# EAGLE design ibz_bldc_drv_revA (EAGLE 9.6.2)

## Sheet 1 of 6: Blockschema
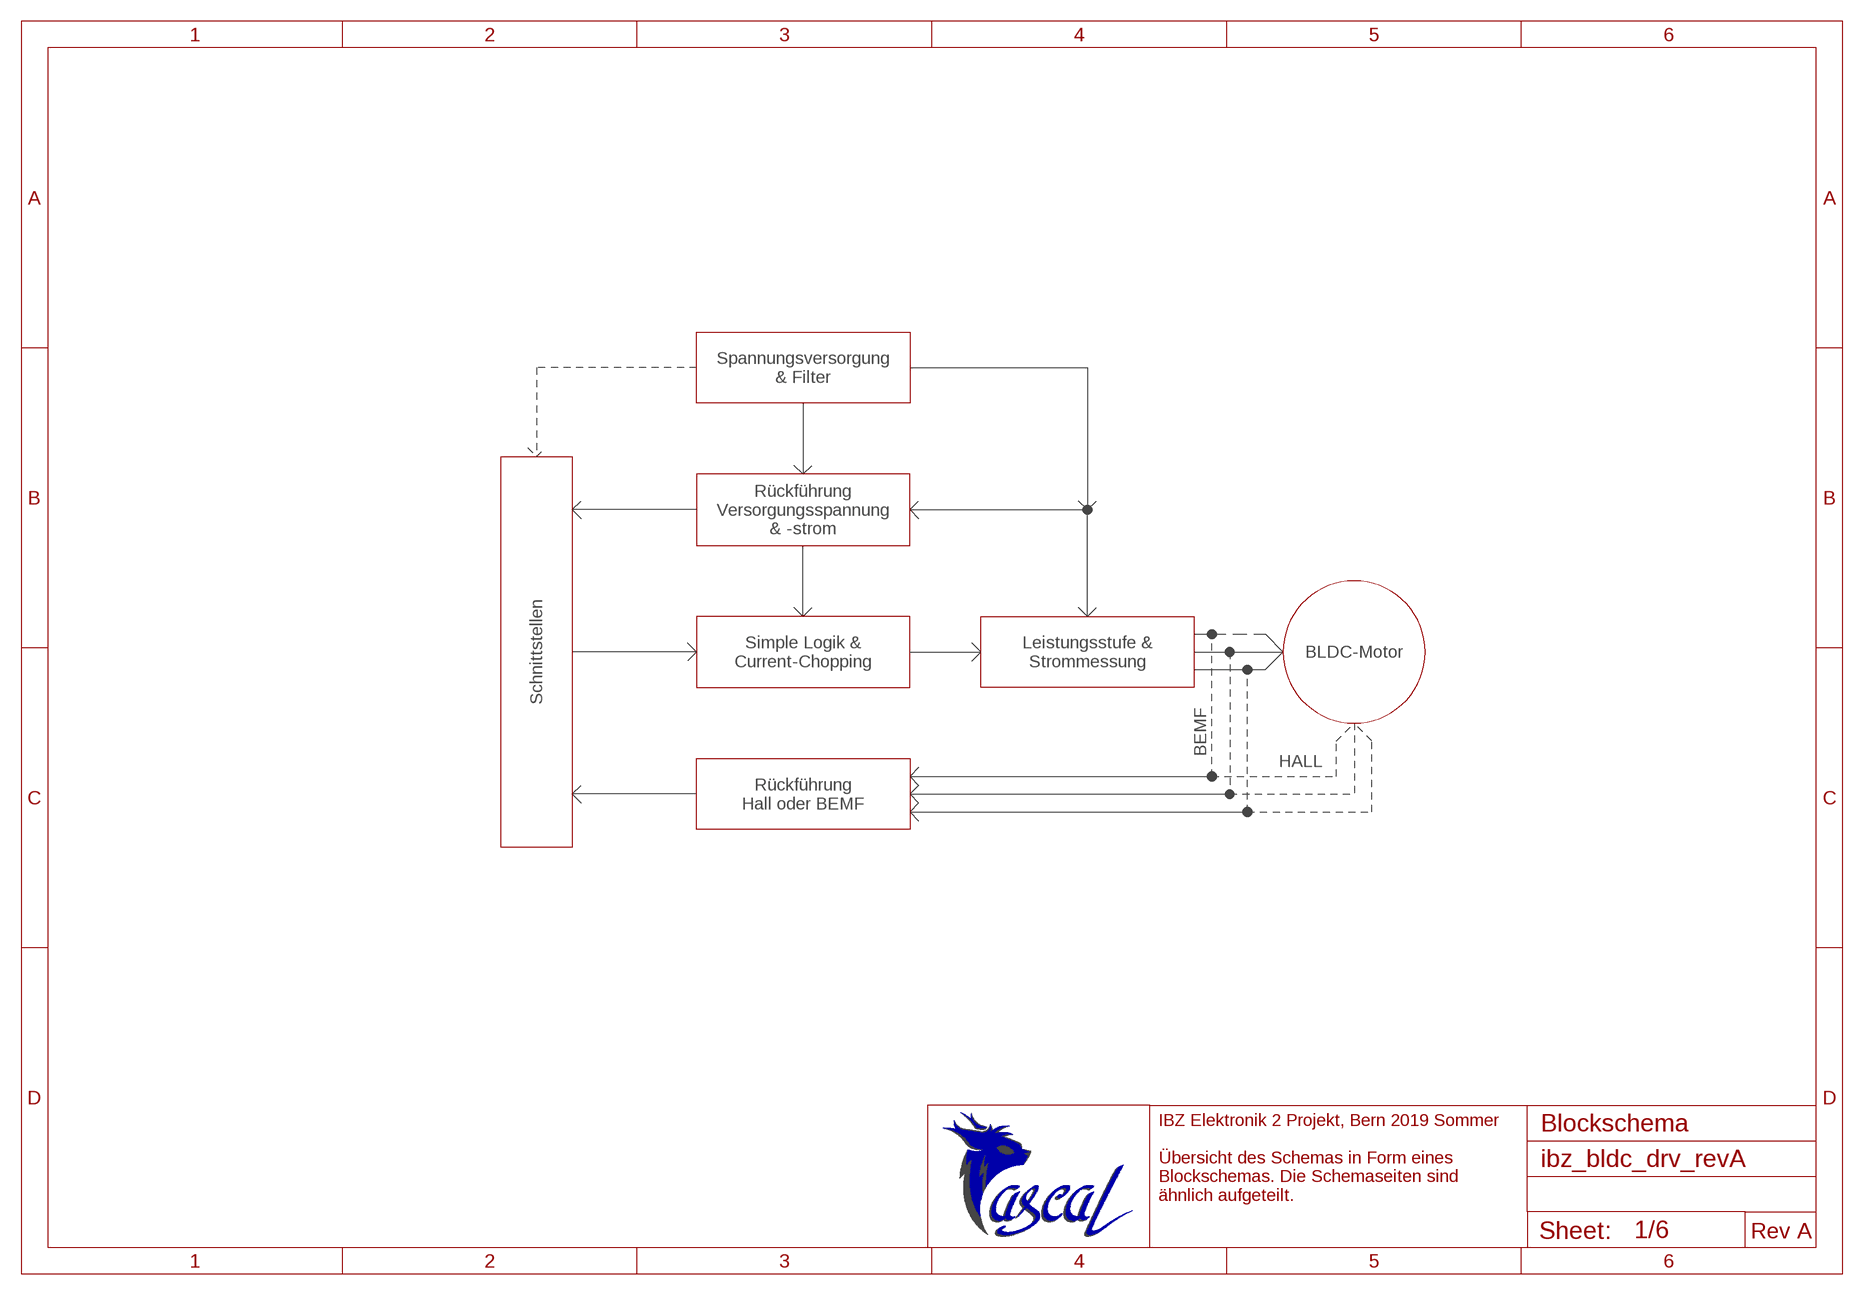
[diagram p0: schematic, sheet 1]

### Notes on the sheet
- Spannungsversorgung
  & Filter
- Rückführung
  Versorgungsspannung
  & -strom
- Schnittstellen
- Simple Logik &
  Current-Chopping
- Leistungsstufe &
  Strommessung
- BLDC-Motor
- BEMF
- HALL
- Rückführung
  Hall oder BEMF
- IBZ Elektronik 2 Projekt, Bern 2019 Sommer
  
  Übersicht des Schemas in Form eines
  Blockschemas. Die Schemaseiten sind 
  ähnlich aufgeteilt.
- Blockschema
- Rev A

## Sheet 2 of 6: Spannungsversorgung und Filter
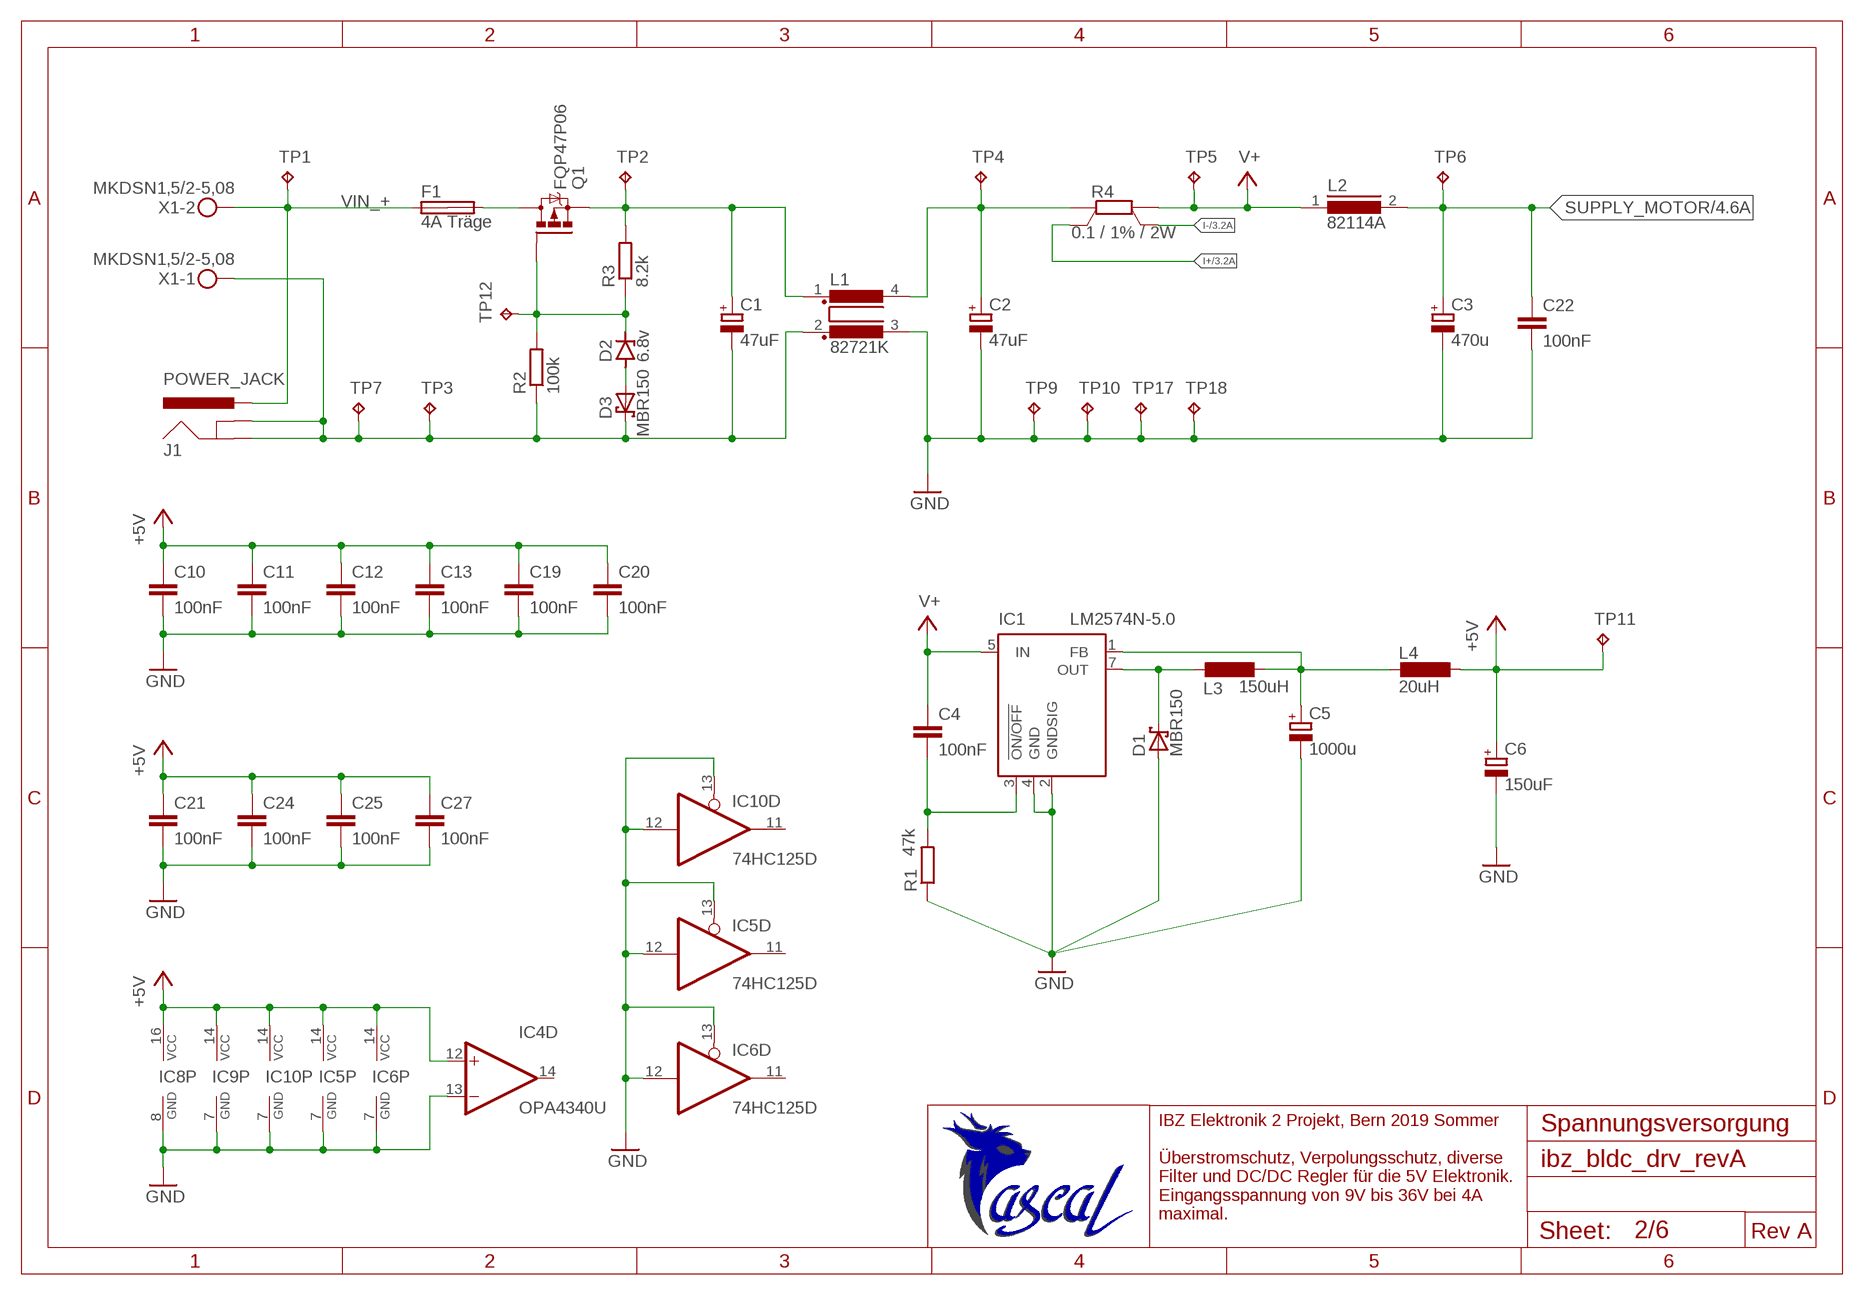
[diagram p1: schematic, sheet 2]

### Parts
C1  47uF  CPOL-EUE22-9AXIAL  [E22-9]
C2  47uF  CPOL-EUE22-9AXIAL  [E22-9]
C3  470u  CPOL-EUE22-9AXIAL  [E22-9]
C4  100nF  C-EUC1206  [C1206]
C5  1000u  CPOL-EUE5-10.5  [E5-10,5]
C6  150uF  CPOL-EU153CLV-1010  [153CLV-1010]
C10  100nF  C-EUC1206  [C1206]
C11  100nF  C-EUC1206  [C1206]
C12  100nF  C-EUC1206  [C1206]
C13  100nF  C-EUC1206  [C1206]
C19  100nF  C-EUC1206  [C1206]
C20  100nF  C-EUC1206  [C1206]
C21  100nF  C-EUC1206  [C1206]
C22  100nF  C-EUC1206  [C1206]
C24  100nF  C-EUC1206  [C1206]
C25  100nF  C-EUC1206  [C1206]
C27  100nF  C-EUC1206  [C1206]
D1  MBR150  SCHOTTKY-DIODEDO41-7  [DO41-7]
D2  6.8v  ZENER-DIODEDO41Z10  [DO41Z10]
D3  MBR150  SCHOTTKY-DIODEDO41-7  [DO41-7]
F1  4A Träge  SHK20Q  [SHK20Q]
IC1  LM2574N-5.0  [DIL08]
IC4  OPA4340U  [SO14]
IC5  74HC125D  [SO14]
IC6  74HC125D  [SO14]
IC8  74HC123D  74LS123D  [SO16]
IC9  74HC08D  74AC08D  [SO14]
IC10  74HC125D  74AC125D  [SO14]
J1  POWER_JACK  [POWER_JACK_PTH]
L1  82721K  [82721K]
L2  82114A  [82114A]
L3  150uH  L-EUIR-2  [IR-2]
L4  20uH  L-EUL5038P  [L5038P]
Q1  FQP47P06  IRF9530  [TO220BV]
R1  47k  R-EU_R1206  [R1206]
R2  100k  R-EU_R1206  [R1206]
R3  8.2k  R-EU_R1206  [R1206]
R4  0.1 / 1% / 2W  PMA-B  [PMA-B]
TP1  TPPAD1-13  [P1-13]
TP2  TPPAD1-13  [P1-13]
TP3  TPPAD1-13  [P1-13]
TP4  TPPAD1-13  [P1-13]
TP5  TPPAD1-13  [P1-13]
TP6  TPPAD1-13  [P1-13]
TP7  TPPAD1-13  [P1-13]
TP9  TPPAD1-13  [P1-13]
TP10  TPPAD1-13  [P1-13]
TP11  TPPAD1-13  [P1-13]
TP12  TPPAD1-13  [P1-13]
TP17  TPPAD1-13  [P1-13]
TP18  TPPAD1-13  [P1-13]
X1  MKDSN1,5/2-5,08  [MKDSN1,5/2-5,08]

### Nets
+5V: C6.+ C10.1 C11.1 C12.1 C13.1 C19.1 C20.1 C21.1 C24.1 C25.1 C27.1 IC4.12(D:+IN) IC5.14(P:VCC) IC6.14(P:VCC) IC8.16(P:VCC) IC9.14(P:VCC) IC10.14(P:VCC) L4.1 TP11.TP ; also sheet 3,4,5,6
GND: C2.- C3.- C5.- C6.- C10.2 C11.2 C12.2 C13.2 C19.2 C20.2 C21.2 C22.2 C24.2 C25.2 C27.2 D1.A IC1.2(GNDSIG) IC1.4(GND) IC4.13(D:-IN) IC5.7(P:GND) IC5.12(D:I) IC5.13(D:OE) IC6.7(P:GND) IC6.12(D:I) IC6.13(D:OE) IC8.8(P:GND) IC9.7(P:GND) IC10.7(P:GND) IC10.12(D:I) IC10.13(D:OE) L1.3 R1.1 TP9.TP TP10.TP TP17.TP TP18.TP ; also sheet 3,4,5,6
I+: R4.SB ; also sheet 3
I-: R4.SA ; also sheet 3
N$1: C1.- D3.C J1.GND J1.GNDBREAK L1.2 R2.1 TP3.TP TP7.TP X1.1
N$2: C1.+ L1.1 Q1.S R3.2 TP2.TP
N$3: C2.+ L1.4 R4.B TP4.TP
N$4: C4.2 IC1.3(!ON/OFF) R1.2
N$5: C5.+ IC1.1(FB) L3.1 L4.2
N$6: D1.C IC1.7(OUT) L3.2
N$7: F1.2A Q1.D
N$8: D2.C Q1.G R2.2 R3.1 TP12.TP
N$9: D2.A D3.A
SUPPLY_MOTOR: C3.+ C22.1 L2.2 TP6.TP ; also sheet 4
V+: C4.1 IC1.5(IN) L2.1 R4.A TP5.TP ; also sheet 3,6
VIN_+: F1.1A J1.PWR TP1.TP X1.2
Unconnected: F1.1B F1.2B IC4.14(D:OUT) IC5.11(D:O) IC6.11(D:O) IC8.5(B:Q) IC8.6(B:C) IC8.7(B:R/C) IC8.9(B:A) IC8.10(B:B) IC8.11(B:CLR) IC8.12(B:!Q) IC9.11(D:O) IC9.12(D:I0) IC9.13(D:I1) IC10.11(D:O)

### Notes on the sheet
- IBZ Elektronik 2 Projekt, Bern 2019 Sommer
  
  Überstromschutz, Verpolungsschutz, diverse
  Filter und DC/DC Regler für die 5V Elektronik.
  Eingangsspannung von 9V bis 36V bei 4A
  maximal.
- Spannungsversorgung
- Rev A

## Sheet 3 of 6: Rückführung Strom & Spannung
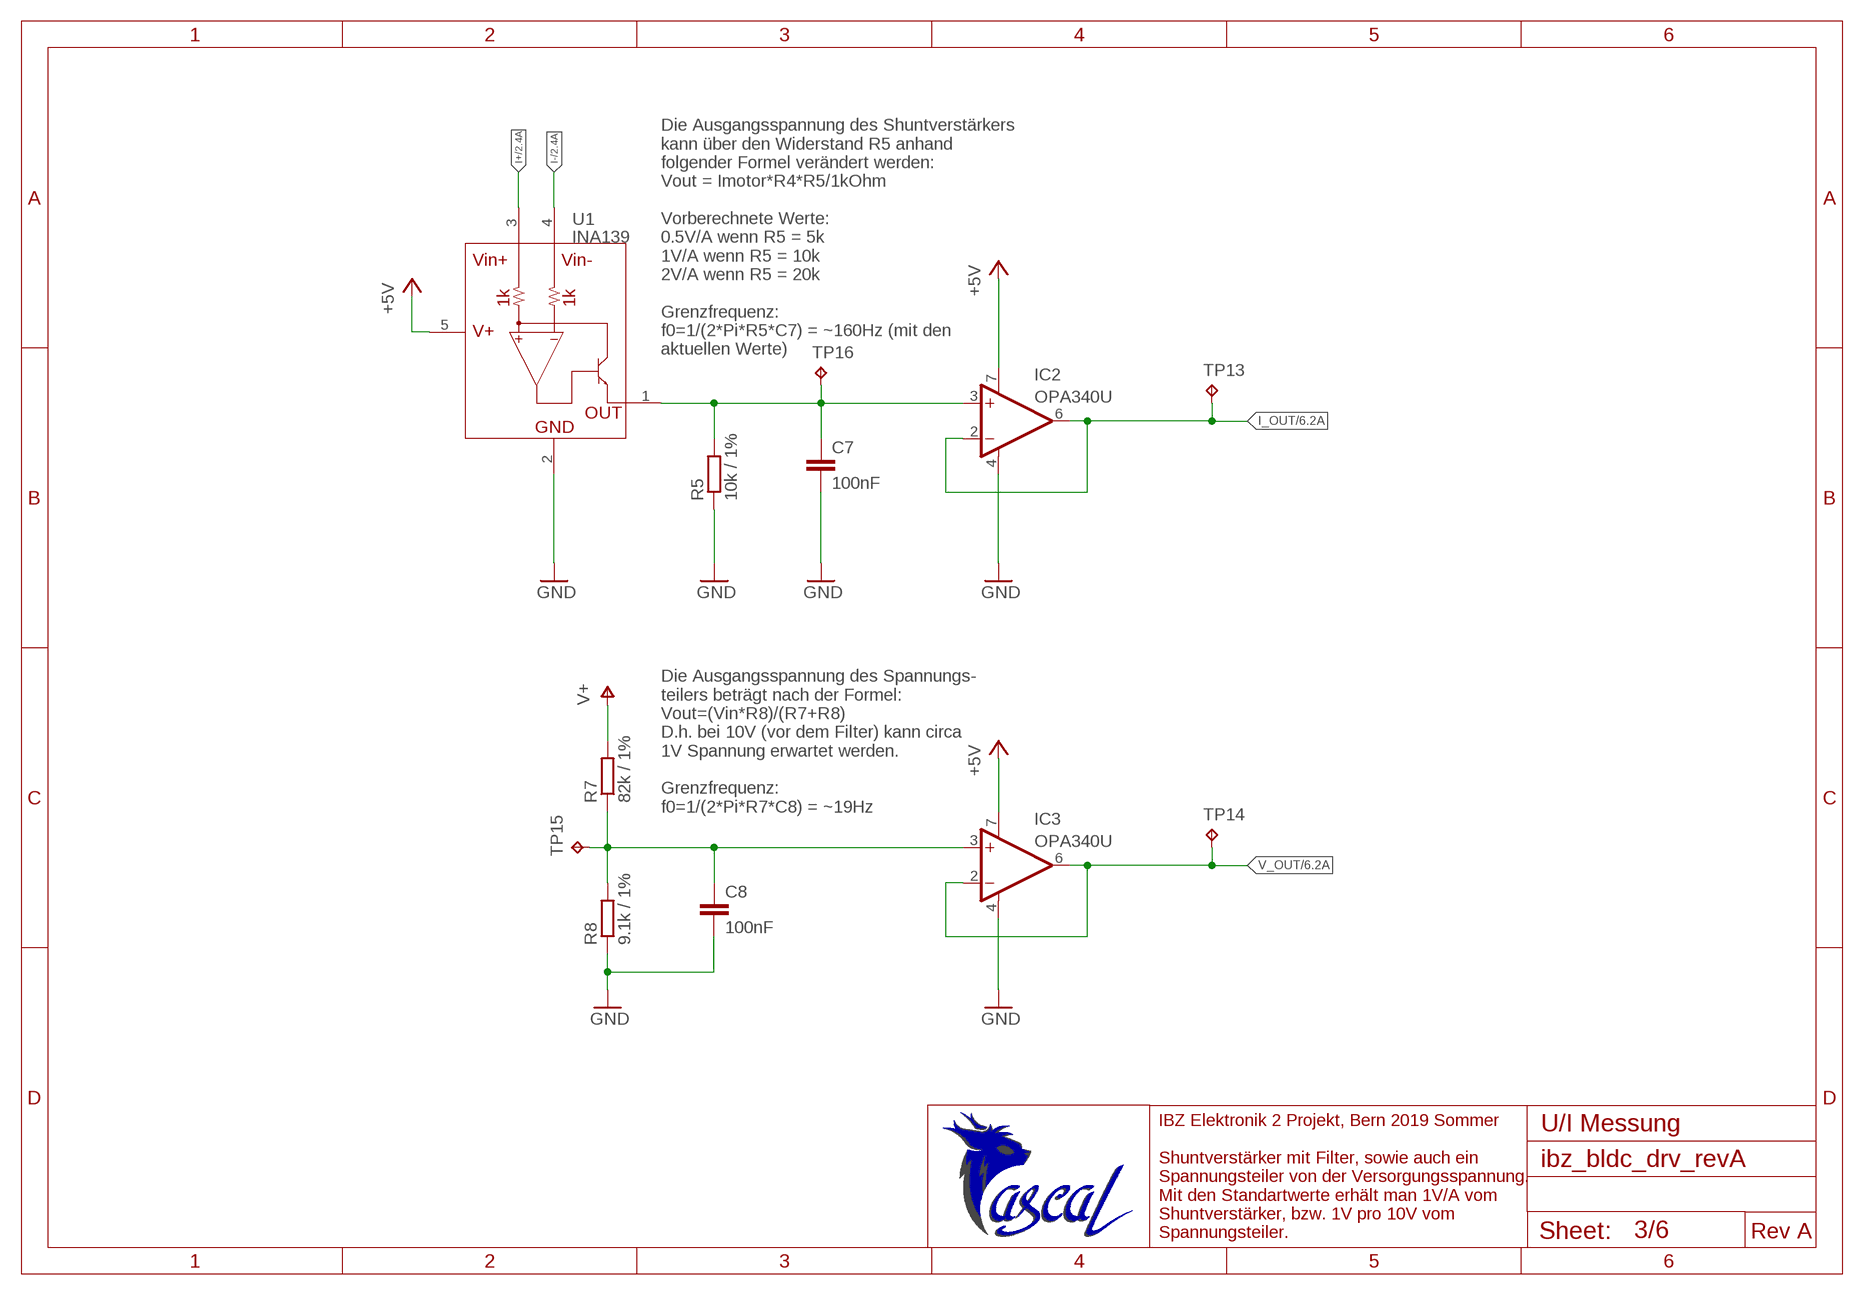
[diagram p2: schematic, sheet 3]

### Parts
C7  100nF  C-EUC1206  [C1206]
C8  100nF  C-EUC1206  [C1206]
IC2  OPA340U  [SO08]
IC3  OPA340U  [SO08]
R5  10k / 1%  R-EU_R1206  [R1206]
R7  82k / 1%  R-EU_R1206  [R1206]
R8  9.1k / 1%  R-EU_R1206  [R1206]
TP13  TPPAD1-13  [P1-13]
TP14  TPPAD1-13  [P1-13]
TP15  TPPAD1-13  [P1-13]
TP16  TPPAD1-13  [P1-13]
U1  INA139  INA169  [SOT23-5]

### Nets
+5V: IC2.7(V+) IC3.7(V+) U1.5(V+) ; also sheet 2,4,5,6
GND: C7.2 C8.2 IC2.4(V-) IC3.4(V-) R5.1 R8.1 U1.2(GND) ; also sheet 2,4,5,6
I+: U1.3(VIN+) ; also sheet 2
I-: U1.4(VIN-) ; also sheet 2
I_OUT: IC2.2(-IN) IC2.6(OUT) TP13.TP ; also sheet 6
N$10: C7.1 IC2.3(+IN) R5.2 TP16.TP U1.1(OUT)
N$13: C8.1 IC3.3(+IN) R7.1 R8.2 TP15.TP
V+: R7.2 ; also sheet 2,6
V_OUT: IC3.2(-IN) IC3.6(OUT) TP14.TP ; also sheet 6

### Notes on the sheet
- Die Ausgangsspannung des Shuntverstärkers
  kann über den Widerstand R5 anhand 
  folgender Formel verändert werden:
  Vout = Imotor*R4*R5/1kOhm
  
  Vorberechnete Werte:
  0.5V/A wenn R5 = 5k
  1V/A wenn R5 = 10k
  2V/A wenn R5 = 20k
  
  Grenzfrequenz:
  f0=1/(2*Pi*R5*C7) = ~160Hz (mit den
  aktuellen Werte)
- Die Ausgangsspannung des Spannungs-
  teilers beträgt nach der Formel:
  Vout=(Vin*R8)/(R7+R8)
  D.h. bei 10V (vor dem Filter) kann circa
  1V Spannung erwartet werden.
  
  Grenzfrequenz:
  f0=1/(2*Pi*R7*C8) = ~19Hz
- IBZ Elektronik 2 Projekt, Bern 2019 Sommer
  
  Shuntverstärker mit Filter, sowie auch ein
  Spannungsteiler von der Versorgungsspannung.
  Mit den Standartwerte erhält man 1V/A vom
  Shuntverstärker, bzw. 1V pro 10V vom
  Spannungsteiler.
- U/I Messung
- Rev A

## Sheet 4 of 6: Leistungsstufe
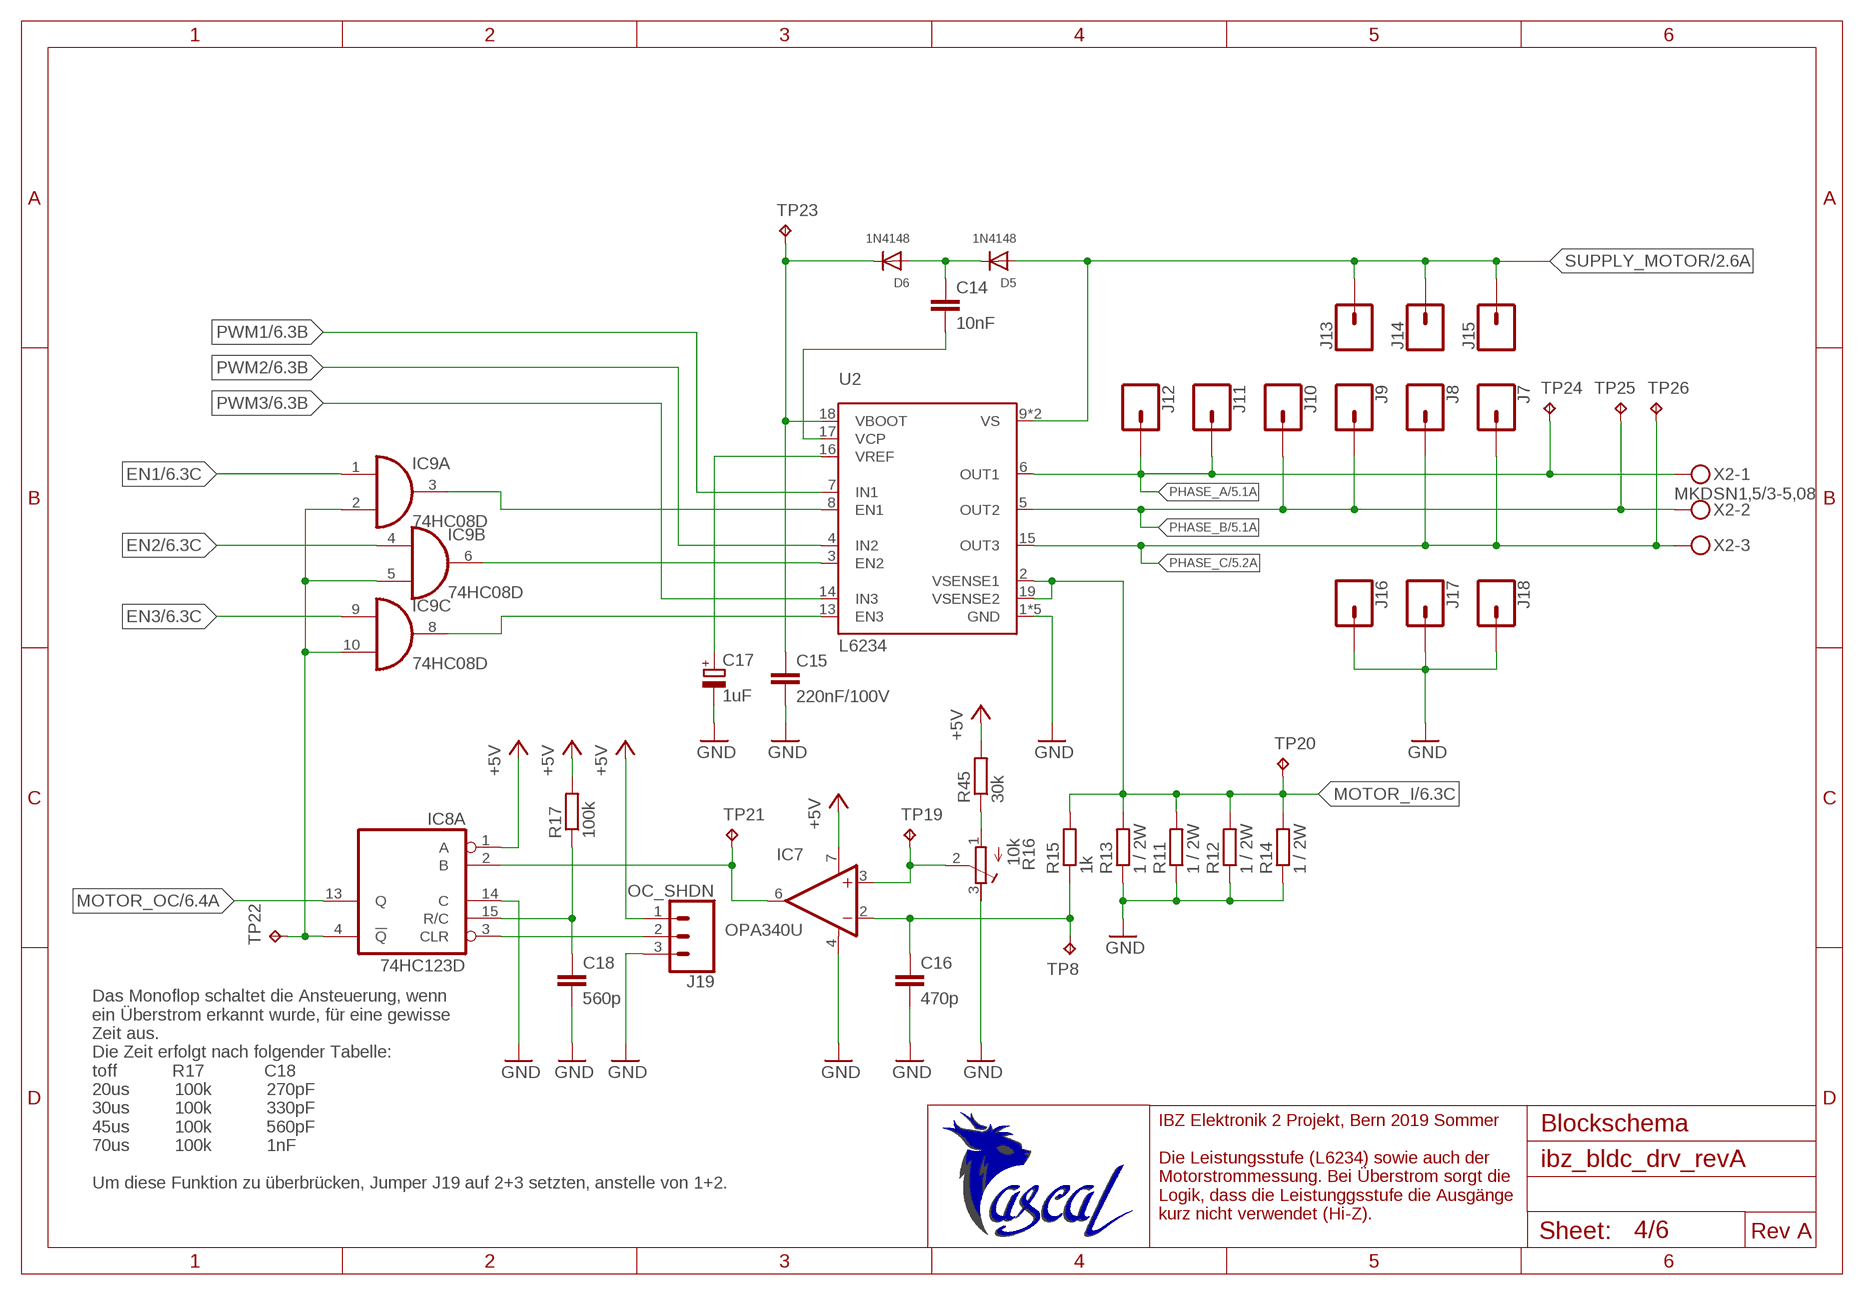
[diagram p3: schematic, sheet 4]

### Parts
C14  10nF  C-EUC1206  [C1206]
C15  220nF/100V  C-EUC1206  [C1206]
C16  470p  C-EUC1206  [C1206]
C17  1uF  CPOL-EU153CLV-0505  [153CLV-0505]
C18  560p  C-EUC1206  [C1206]
D5  1N4148  DIODESMA  [SMADIODE]
D6  1N4148  DIODESMA  [SMADIODE]
IC7  OPA340U  [SO08]
J7  CONN_01PTH_2MM  [1X01_2MM]
J8  CONN_01PTH_2MM  [1X01_2MM]
J9  CONN_01PTH_2MM  [1X01_2MM]
J10  CONN_01PTH_2MM  [1X01_2MM]
J11  CONN_01PTH_2MM  [1X01_2MM]
J12  CONN_01PTH_2MM  [1X01_2MM]
J13  CONN_01PTH_2MM  [1X01_2MM]
J14  CONN_01PTH_2MM  [1X01_2MM]
J15  CONN_01PTH_2MM  [1X01_2MM]
J16  CONN_01PTH_2MM  [1X01_2MM]
J17  CONN_01PTH_2MM  [1X01_2MM]
J18  CONN_01PTH_2MM  [1X01_2MM]
J19  OC_SHDN  CONN_03  [1X03]
R11  1 / 2W  R-EU_0411/15  [0411/15]
R12  1 / 2W  R-EU_0411/15  [0411/15]
R13  1 / 2W  R-EU_0411/15  [0411/15]
R14  1 / 2W  R-EU_0411/15  [0411/15]
R15  1k  R-EU_R1206  [R1206]
R16  10k  R-TRIMM64W  [RTRIM64W]
R17  100k  R-EU_R1206  [R1206]
R45  30k  R-EU_R1206  [R1206]
TP8  TPPAD1-13  [P1-13]
TP19  TPPAD1-13  [P1-13]
TP20  TPPAD1-13  [P1-13]
TP21  TPPAD1-13  [P1-13]
TP22  TPPAD1-13  [P1-13]
TP23  TPPAD1-13  [P1-13]
TP24  TPPAD1-13  [P1-13]
TP25  TPPAD1-13  [P1-13]
TP26  TPPAD1-13  [P1-13]
U2  L6234  [POWERSO20]
X2  MKDSN1,5/3-5,08  [MKDSN1,5/3-5,08]

### Nets
+5V: IC7.7(V+) IC8.1(A:A) J19.1 R17.2 R45.2 ; also sheet 2,3,5,6
EN1: IC9.1(A:I0) ; also sheet 6
EN2: IC9.4(B:I0) ; also sheet 6
EN3: IC9.9(C:I0) ; also sheet 6
GND: C15.2 C16.2 C17.- C18.2 IC7.4(V-) IC8.14(A:C) J16.1 J17.1 J18.1 J19.3 R11.1 R12.1 R13.1 R14.1 R16.3(E) U2.1(GND) U2.10(GND) U2.11(GND) U2.20(GND) U2.PAD(GND) ; also sheet 2,3,5,6
MOTOR_I: R11.2 R12.2 R13.2 R14.2 R15.2 TP20.TP U2.2(VSENSE1) U2.19(VSENSE2) ; also sheet 6
MOTOR_OC: IC8.13(A:Q) ; also sheet 6
N$15: C14.1 D5.C D6.A
N$18: IC9.3(A:O) U2.8(EN1)
N$19: C15.1 D6.C TP23.TP U2.18(VBOOT)
N$21: C14.2 U2.17(VCP)
N$22: C17.+ U2.16(VREF)
N$24: IC9.6(B:O) U2.3(EN2)
N$25: IC9.8(C:O) U2.13(EN3)
N$26: C16.1 IC7.2(-IN) R15.1 TP8.TP
N$27: IC8.4(A:!Q) IC9.2(A:I1) IC9.5(B:I1) IC9.10(C:I1) TP22.TP
N$28: IC7.6(OUT) IC8.2(A:B) TP21.TP
N$29: C18.1 IC8.15(A:R/C) R17.1
N$30: IC8.3(A:CLR) J19.2
N$31: IC7.3(+IN) R16.2(S) TP19.TP
N$37: R16.1(A) R45.1
PHASE_A: J11.1 J12.1 TP24.TP U2.6(OUT1) X2.1 ; also sheet 5
PHASE_B: J9.1 J10.1 TP25.TP U2.5(OUT2) X2.2 ; also sheet 5
PHASE_C: J7.1 J8.1 TP26.TP U2.15(OUT3) X2.3 ; also sheet 5
PWM1: U2.7(IN1) ; also sheet 6
PWM2: U2.4(IN2) ; also sheet 6
PWM3: U2.14(IN3) ; also sheet 6
SUPPLY_MOTOR: D5.A J13.1 J14.1 J15.1 U2.9(VS) U2.12(VS) ; also sheet 2

### Notes on the sheet
- Das Monoflop schaltet die Ansteuerung, wenn
  ein Überstrom erkannt wurde, für eine gewisse
  Zeit aus.
  Die Zeit erfolgt nach folgender Tabelle:
  toff           R17            C18
  20us         100k           270pF
  30us         100k           330pF
  45us         100k           560pF
  70us         100k           1nF
  
  Um diese Funktion zu überbrücken, Jumper J19 auf 2+3 setzten, anstelle von 1+2.
- IBZ Elektronik 2 Projekt, Bern 2019 Sommer
  
  Die Leistungsstufe (L6234) sowie auch der
  Motorstrommessung. Bei Überstrom sorgt die
  Logik, dass die Leistunggsstufe die Ausgänge
  kurz nicht verwendet (Hi-Z).
- Blockschema
- Rev A

## Sheet 5 of 6: BEMF / Hall Auswertung
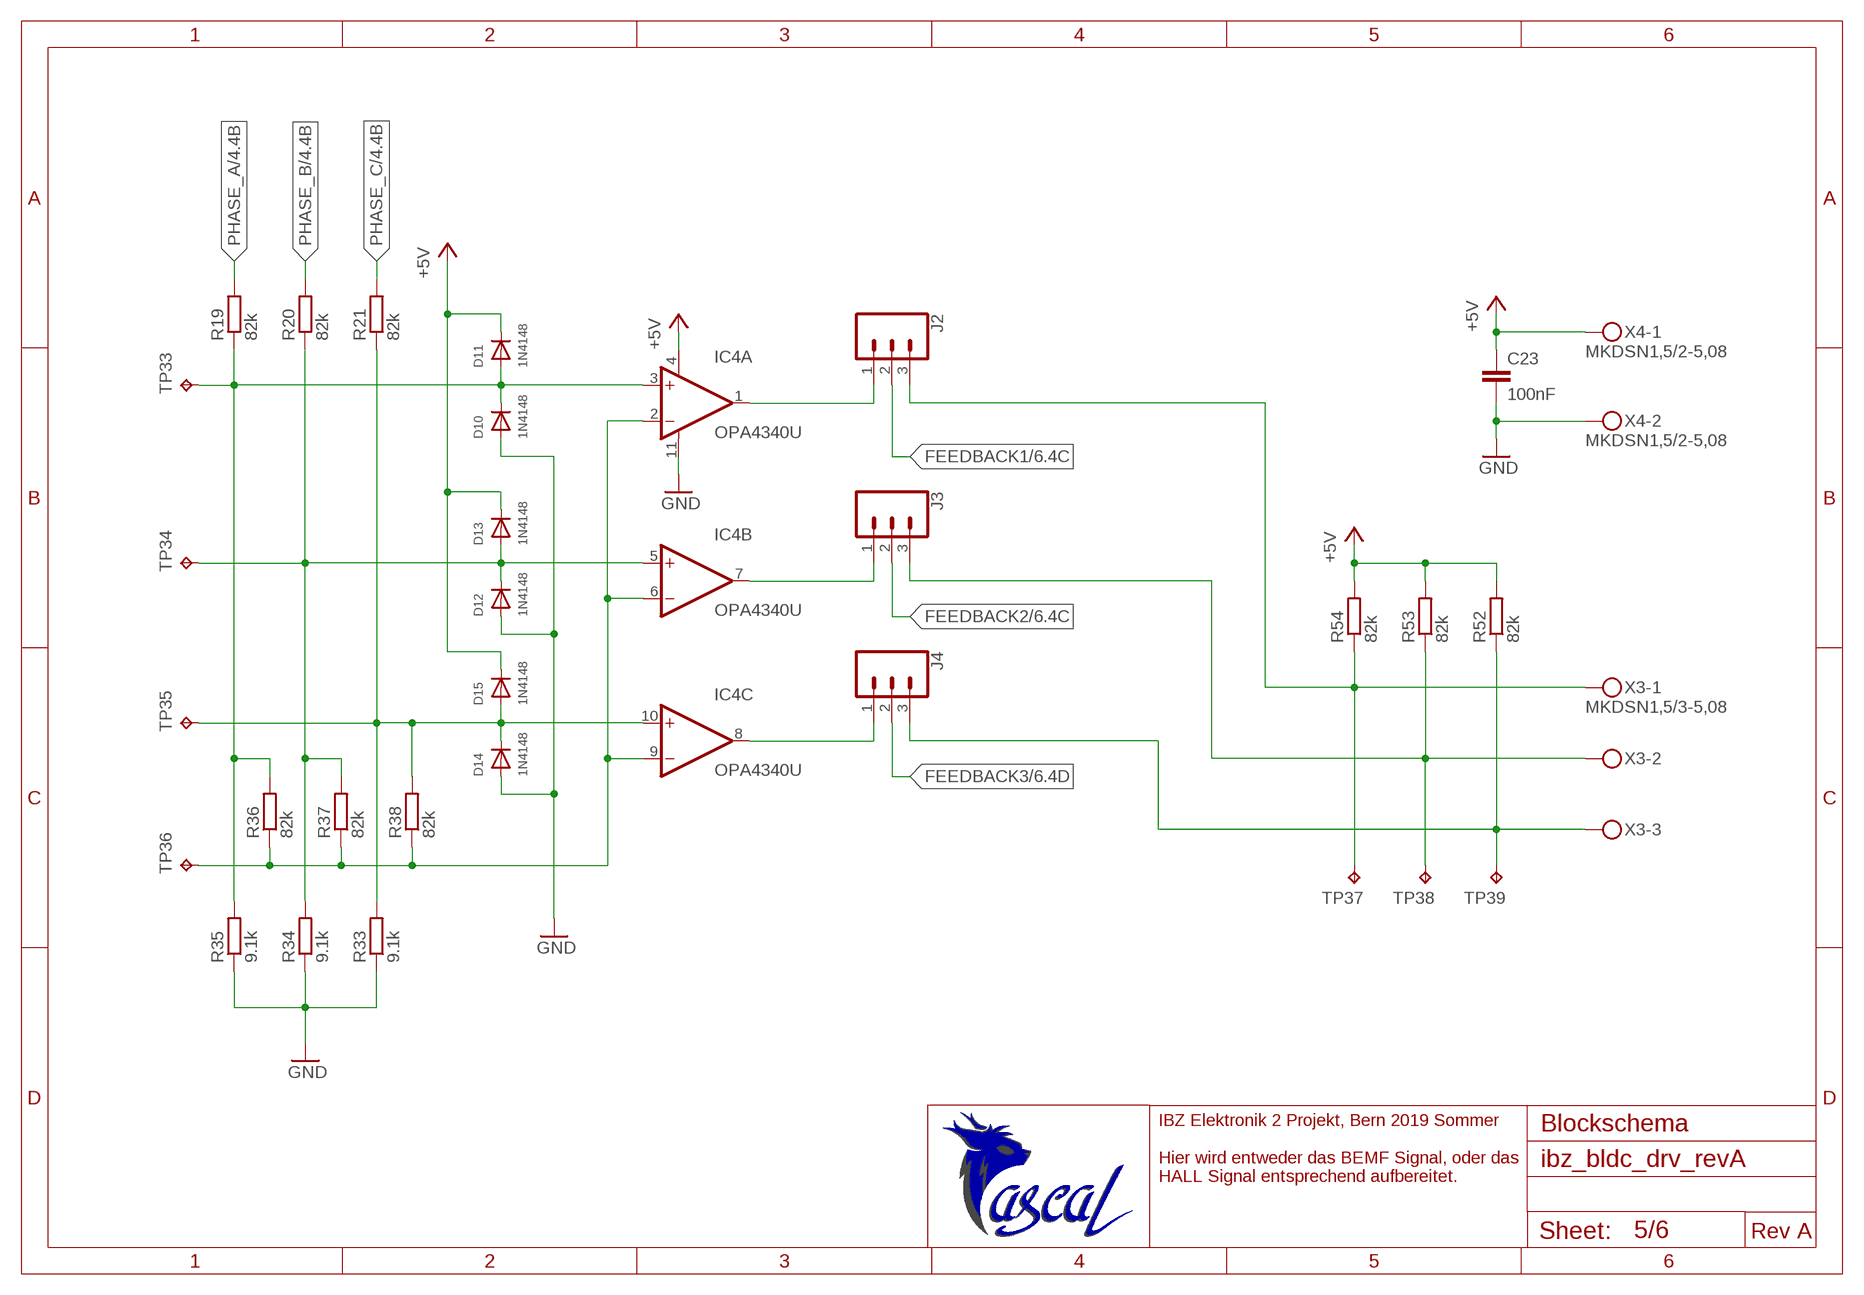
[diagram p4: schematic, sheet 5]

### Parts
C23  100nF  C-EUC1206  [C1206]
D10  1N4148  DIODESMA  [SMADIODE]
D11  1N4148  DIODESMA  [SMADIODE]
D12  1N4148  DIODESMA  [SMADIODE]
D13  1N4148  DIODESMA  [SMADIODE]
D14  1N4148  DIODESMA  [SMADIODE]
D15  1N4148  DIODESMA  [SMADIODE]
J2  CONN_03  [1X03]
J3  CONN_03  [1X03]
J4  CONN_03  [1X03]
R19  82k  R-EU_R1206  [R1206]
R20  82k  R-EU_R1206  [R1206]
R21  82k  R-EU_R1206  [R1206]
R33  9.1k  R-EU_R1206  [R1206]
R34  9.1k  R-EU_R1206  [R1206]
R35  9.1k  R-EU_R1206  [R1206]
R36  82k  R-EU_R1206  [R1206]
R37  82k  R-EU_R1206  [R1206]
R38  82k  R-EU_R1206  [R1206]
R52  82k  R-EU_R1206  [R1206]
R53  82k  R-EU_R1206  [R1206]
R54  82k  R-EU_R1206  [R1206]
TP33  TPPAD1-13  [P1-13]
TP34  TPPAD1-13  [P1-13]
TP35  TPPAD1-13  [P1-13]
TP36  TPPAD1-13  [P1-13]
TP37  TPPAD1-13  [P1-13]
TP38  TPPAD1-13  [P1-13]
TP39  TPPAD1-13  [P1-13]
X3  MKDSN1,5/3-5,08  [MKDSN1,5/3-5,08]
X4  MKDSN1,5/2-5,08  [MKDSN1,5/2-5,08]

### Nets
+5V: C23.1 D11.C D13.C D15.C IC4.4(A:V+) R52.2 R53.2 R54.2 X4.1 ; also sheet 2,3,4,6
FEEDBACK1: J2.2 ; also sheet 6
FEEDBACK2: J3.2 ; also sheet 6
FEEDBACK3: J4.2 ; also sheet 6
GND: C23.2 D10.A D12.A D14.A IC4.11(A:V-) R33.1 R34.1 R35.1 X4.2 ; also sheet 2,3,4,6
N$16: D14.C D15.A IC4.10(C:+IN) R21.1 R33.2 R38.2 TP35.TP
N$17: D10.C D11.A IC4.3(A:+IN) R19.1 R35.2 R36.2 TP33.TP
N$20: D12.C D13.A IC4.5(B:+IN) R20.1 R34.2 R37.2 TP34.TP
N$32: IC4.1(A:OUT) J2.1
N$34: IC4.2(A:-IN) IC4.6(B:-IN) IC4.9(C:-IN) R36.1 R37.1 R38.1 TP36.TP
N$35: IC4.7(B:OUT) J3.1
N$36: IC4.8(C:OUT) J4.1
N$59: J2.3 R54.1 TP37.TP X3.1
N$60: J3.3 R53.1 TP38.TP X3.2
N$61: J4.3 R52.1 TP39.TP X3.3
PHASE_A: R19.2 ; also sheet 4
PHASE_B: R20.2 ; also sheet 4
PHASE_C: R21.2 ; also sheet 4

### Notes on the sheet
- IBZ Elektronik 2 Projekt, Bern 2019 Sommer
  
  Hier wird entweder das BEMF Signal, oder das
  HALL Signal entsprechend aufbereitet.
- Blockschema
- Rev A

## Sheet 6 of 6: Schnittstellen
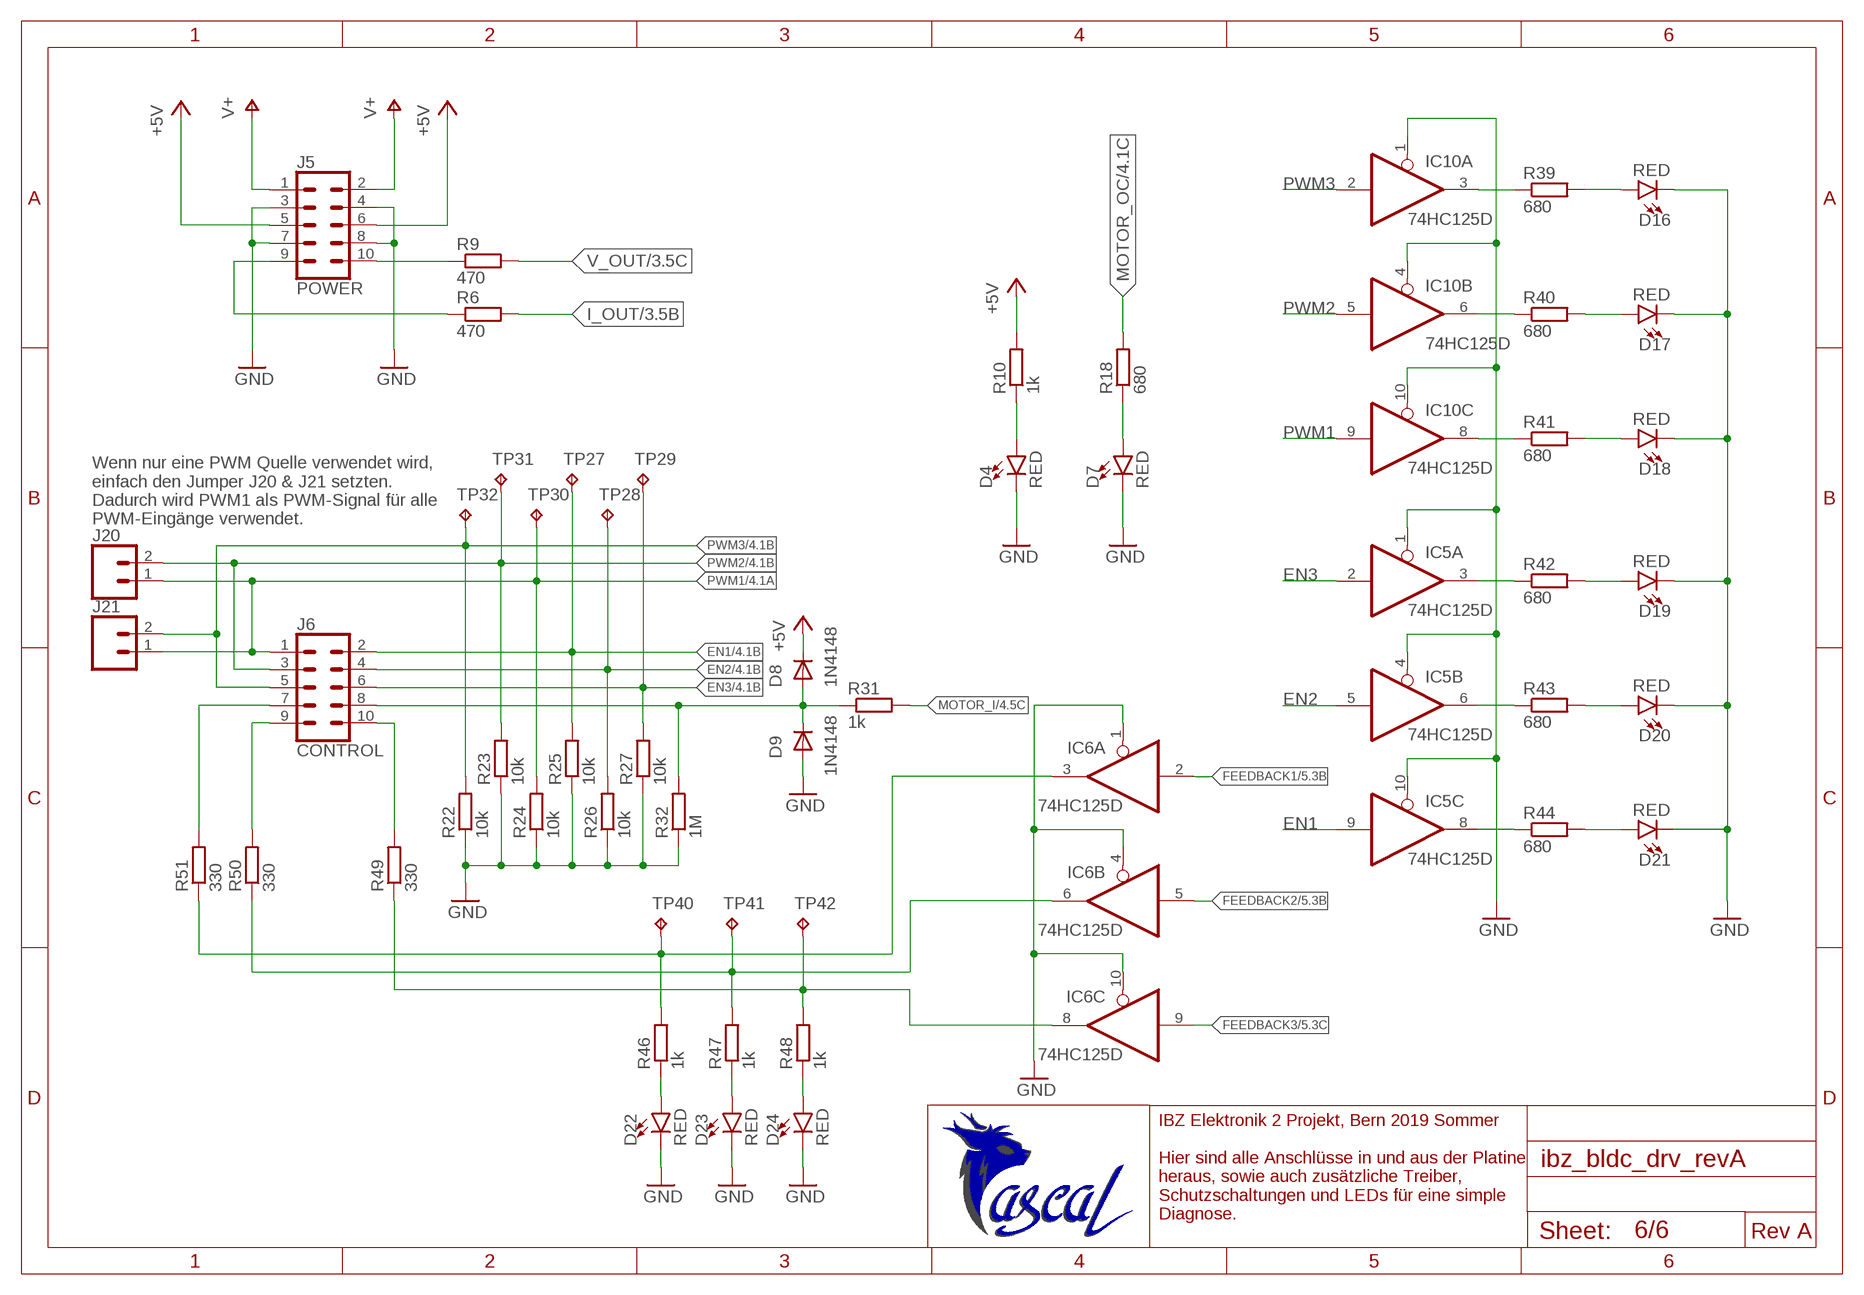
[diagram p5: schematic, sheet 6]

### Parts
D4  RED  LED-RED1206  [LED-1206]
D7  RED  LED-RED1206  [LED-1206]
D8  1N4148  DIODESMA  [SMADIODE]
D9  1N4148  DIODESMA  [SMADIODE]
D16  RED  LED-RED1206  [LED-1206]
D17  RED  LED-RED1206  [LED-1206]
D18  RED  LED-RED1206  [LED-1206]
D19  RED  LED-RED1206  [LED-1206]
D20  RED  LED-RED1206  [LED-1206]
D21  RED  LED-RED1206  [LED-1206]
D22  RED  LED-RED1206  [LED-1206]
D23  RED  LED-RED1206  [LED-1206]
D24  RED  LED-RED1206  [LED-1206]
J5  POWER  CONN_05X2SHD  [2X5-SHROUDED]
J6  CONTROL  CONN_05X2SHD  [2X5-SHROUDED]
J20  CONN_02  [1X02]
J21  CONN_02  [1X02]
R6  470  R-EU_M1206  [M1206]
R9  470  R-EU_M1206  [M1206]
R10  1k  R-EU_R1206  [R1206]
R18  680  R-EU_R1206  [R1206]
R22  10k  R-EU_R1206  [R1206]
R23  10k  R-EU_R1206  [R1206]
R24  10k  R-EU_R1206  [R1206]
R25  10k  R-EU_R1206  [R1206]
R26  10k  R-EU_R1206  [R1206]
R27  10k  R-EU_R1206  [R1206]
R31  1k  R-EU_R1206  [R1206]
R32  1M  R-EU_R1206  [R1206]
R39  680  R-EU_R1206  [R1206]
R40  680  R-EU_R1206  [R1206]
R41  680  R-EU_R1206  [R1206]
R42  680  R-EU_R1206  [R1206]
R43  680  R-EU_R1206  [R1206]
R44  680  R-EU_R1206  [R1206]
R46  1k  R-EU_R1206  [R1206]
R47  1k  R-EU_R1206  [R1206]
R48  1k  R-EU_R1206  [R1206]
R49  330  R-EU_R1206  [R1206]
R50  330  R-EU_R1206  [R1206]
R51  330  R-EU_R1206  [R1206]
TP27  TPPAD1-13  [P1-13]
TP28  TPPAD1-13  [P1-13]
TP29  TPPAD1-13  [P1-13]
TP30  TPPAD1-13  [P1-13]
TP31  TPPAD1-13  [P1-13]
TP32  TPPAD1-13  [P1-13]
TP40  TPPAD1-13  [P1-13]
TP41  TPPAD1-13  [P1-13]
TP42  TPPAD1-13  [P1-13]

### Nets
+5V: D8.C J5.5 J5.6 R10.2 ; also sheet 2,3,4,5
EN1: IC5.9(C:I) J6.2 R25.2 TP27.TP ; also sheet 4
EN2: IC5.5(B:I) J6.4 R26.2 TP28.TP ; also sheet 4
EN3: IC5.2(A:I) J6.6 R27.2 TP29.TP ; also sheet 4
FEEDBACK1: IC6.2(A:I) ; also sheet 5
FEEDBACK2: IC6.5(B:I) ; also sheet 5
FEEDBACK3: IC6.9(C:I) ; also sheet 5
GND: D4.C D7.C D9.A D16.C D17.C D18.C D19.C D20.C D21.C D22.C D23.C D24.C IC5.1(A:OE) IC5.4(B:OE) IC5.10(C:OE) IC6.1(A:OE) IC6.4(B:OE) IC6.10(C:OE) IC10.1(A:OE) IC10.4(B:OE) IC10.10(C:OE) J5.3 J5.4 J5.7 J5.8 R22.1 R23.1 R24.1 R25.1 R26.1 R27.1 R32.1 ; also sheet 2,3,4,5
I_OUT: R6.2 ; also sheet 3
MOTOR_I: R31.2 ; also sheet 4
MOTOR_OC: R18.2 ; also sheet 4
N$11: D4.A R10.1
N$12: J5.9 R6.1
N$14: J5.10 R9.1
N$23: D7.A R18.1
N$33: D8.A D9.C J6.8 R31.1 R32.2
N$38: IC10.3(A:O) R39.1
N$39: IC10.6(B:O) R40.1
N$40: IC10.8(C:O) R41.1
N$41: IC5.3(A:O) R42.1
N$42: D19.A R42.2
N$43: D18.A R41.2
N$44: D17.A R40.2
N$45: D16.A R39.2
N$46: IC5.6(B:O) R43.1
N$47: D20.A R43.2
N$48: IC5.8(C:O) R44.1
N$49: D21.A R44.2
N$50: J6.10 R49.2
N$51: IC6.8(C:O) R48.2 R49.1 TP42.TP
N$52: IC6.6(B:O) R47.2 R50.1 TP41.TP
N$53: IC6.3(A:O) R46.2 R51.1 TP40.TP
N$54: D22.A R46.1
N$55: D23.A R47.1
N$56: D24.A R48.1
N$57: J6.9 R50.2
N$58: J6.7 R51.2
PWM1: IC10.9(C:I) J6.1 J20.1 J21.1 R24.2 TP30.TP ; also sheet 4
PWM2: IC10.5(B:I) J6.3 J20.2 R23.2 TP31.TP ; also sheet 4
PWM3: IC10.2(A:I) J6.5 J21.2 R22.2 TP32.TP ; also sheet 4
V+: J5.1 J5.2 ; also sheet 2,3
V_OUT: R9.2 ; also sheet 3

### Notes on the sheet
- Wenn nur eine PWM Quelle verwendet wird,
  einfach den Jumper J20 & J21 setzten.
  Dadurch wird PWM1 als PWM-Signal für alle
  PWM-Eingänge verwendet.
- IBZ Elektronik 2 Projekt, Bern 2019 Sommer
  
  Hier sind alle Anschlüsse in und aus der Platine
  heraus, sowie auch zusätzliche Treiber,
  Schutzschaltungen und LEDs für eine simple
  Diagnose.
- Rev A

## Library data of the parts
C1-C3 C5 C6 C17 = rcl:CPOL-EU: POLARIZED CAPACITOR, European symbol; SPICEPREFIX: C
C4 C7 C8 C10-C16 C18-C25 C27 = rcl:C-EU: CAPACITOR, European symbol; SPICEPREFIX: C
D1 D3 = adafruit:SCHOTTKY-DIODE: Schottky Diode
D2 = diode:ZENER-DIODE: Z-Diode
D4 D7 D16-D24 = SparkFun-LED:LED-RED: Red SMD LED Used in manufacturing of most products at SparkFun Packages: 0603 - SMD 0603 package [Product Link] <http://docs.avagotech.com/docs/AV02-0551EN> 0603 SMART - SMD 0603 SMART package ( more efficient and expensive)[Product Link] <http://www.osram-os.com/Graphics/XPic2/00077099_0.pdf> 1206 - SMD1206 package [Product Link] <https://www.sparkfun.com/datasheets/DevTools/LilyPad/Q150OVS4.pdff> SparkFun Products: Pro Mini 328 -5V <https://www.sparkfun.com/products/821> RedBoard <https://www.sparkfun.com/products/12757> IOIO-OTG <https://www.sparkfun.com/products/13613>; PROD_ID: DIO-09912
D5 D6 D8-D15 = adafruit:DIODE: Diode SMADIODE - SMA Surface Mount Package 20V 1A Schottky Diode Digikey: 641-1014-6-ND DO-1N4148 - Through Hole Small Current Diode SOD-123 20V 1 A (.5mV Vf) Schottky Diode - Digikey: MBRX120TPMSCT-ND SOD-323 10V 570mA (.38mV Vf, 3ns) Schottky Diode - Digikey: ZLLS410CT-ND SOD-523 30V 30mA Schottky Diode (RB751S-40TE61) - Digikey: RB751S-40TE61CT-ND SOT23-R/W - SOT23 Package (R = Solder Paste/Reflow Ovens, W = Hand-Soldering) BAT54Film 40V 300mA - Digikey: 497-7162-1-ND
F1 = fuse:SHK20Q: FUSE HOLDER 5 x 20 mm, SH contact, E1207 Buerklin 64G6061; OC_FARNELL: unknown; OC_NEWARK: unknown
IC1 = linear:LM2574?-*: SIMPLE SWITCHER 0.5A Step-Down Voltage Regulator Source: http://cache.national.com/ds/LM/LM2574.pdf
IC2 IC3 IC7 = burr-brown:OPA340: Rail-to-Rail Operational Amplifiers Single-Supply, MicroAmplifier(TM) Series; MPN: OPA340UA; OC_FARNELL: 1106196; OC_NEWARK: 24M5449
IC4 = burr-brown:OPA4340: Operational Amplifiers Source: http://focus.ti.com/lit/ds/sbos073/sbos073.pdf; MF: TEXAS INSTRUMENTS; MPN: OPA4340UA; OC_FARNELL: 1212307; OC_NEWARK: 35C1907
IC5 IC6 IC10 = 74xx-eu:74*125: Quad bus BUFFER, 3-state
IC8 = 74xx-eu:74*123: Retriggerable monostable MULTIVIBRATOR
IC9 = 74xx-eu:74*08: Quad 2-input AND gate
J1 = SparkFun-Connectors:POWER_JACK: Power Jack Connector This is the standard 5.5mm barrel jack for power. The PTH is the most common, proven, reliable, footprint. The Slot footprint only works if the mill layer is transmitted to the PCB fab house so be warned. Here are the connectors we sell at SparkFun: DC Barrel Power Jack/Connector <https://www.sparkfun.com/products/119> (PRT-00119) DC Barrel Power Jack/Connector (SMD) <https://www.sparkfun.com/products/12748> (PRT-12748) DC Barrel Jack Adapter - Breadboard Compatible <https://www.sparkfun.com/products/10811> (PRT-10811) It is used on this SparkFun product (and many, many others): SparkFun RedBoard - Programmed with Arduino <https://www.sparkfun.com/products/12757> (DEV-12757) Also, if you need a mating power supply or connector, please check these out: Wall Adapter Power Supply - 9VDC 650mA <https://www.sparkfun.com/products/298> (TOL-00298) DC Barrel Jack Adapter - Male <https://www.sparkfun.com/products/10287> (PRT-10287); PROD_ID: CONN-08197
J2-J4 J19 = SparkFun-Connectors:CONN_03: Multi connection point. Often used as Generic Header-pin footprint for 0.1 inch spaced/style header connections On any of the 0.1 inch spaced packages, you can populate with these: Break Away Headers - Straight <https://www.sparkfun.com/products/116> (PRT-00116) Break Away Male Headers - Right Angle <https://www.sparkfun.com/products/553> (PRT-00553) Female Headers <https://www.sparkfun.com/products/115> (PRT-00115) Break Away Headers - Machine Pin <https://www.sparkfun.com/products/117> (PRT-00117) Break Away Female Headers - Swiss Machine Pin <https://www.sparkfun.com/products/743> (PRT-00743) Stackable Header - 3 Pin (Female, 0.1") <https://www.sparkfun.com/products/13875> (PRT-13875) For SCREWTERMINALS and SPRING TERMINALS visit here: Screw Terimnals on SparkFun.com <https://www.sparkfun.com/search/results?term=Screw+Terminals> (5mm/3.5mm/2.54mm spacing) This device is also useful as a general connection point to wire up your design to another part of your project. Our various solder wires solder well into these plated through hole pads. Hook-Up Wire - Assortment (Stranded, 22 AWG) <https://www.sparkfun.com/products/11375> (PRT-11375) Hook-Up Wire - Assortment (Solid Core, 22 AWG) <https://www.sparkfun.com/products/11367> (PRT-11367) View the entire wire category on our website here <https://www.sparkfun.com/categories/141> Special notes: Molex polarized connector foot print use with SKU : PRT-08232 with associated crimp pins and housings.
J5 J6 = SparkFun-Connectors:CONN_05X2: Multi connection point. Often used as Generic Header-pin footprint for 0.1 inch spaced/style header connections For AVR SPI programming port, see special device with nice symbol: "AVR_SPI_PROG_5x2.dev" You can populate with any combo of single row headers, but if you'd like an exact match, check these: 2x5 AVR ICSP Male Header <https://www.sparkfun.com/products/778> (PRT-00778) 2x5 Pin Shrouded Header <https://www.sparkfun.com/products/8506> (PRT-08506) On any of the 0.1 inch spaced packages, you can populate with these: Break Away Headers - Straight <https://www.sparkfun.com/products/116> (PRT-00116) Break Away Male Headers - Right Angle <https://www.sparkfun.com/products/553> (PRT-00553) Female Headers <https://www.sparkfun.com/products/115> (PRT-00115) Break Away Headers - Machine Pin <https://www.sparkfun.com/products/117> (PRT-00117) Break Away Female Headers - Swiss Machine Pin <https://www.sparkfun.com/products/743> (PRT-00743) Special note: the shrouded connector mates well with our 5x2 ribbon cables: 2x5 Pin IDC Ribbon Cable <https://www.sparkfun.com/products/8535> (PRT-08535); PROD_ID: CONN-08671; SF_ID: PRT-08506
J7-J18 = SparkFun-Connectors:CONN_01: Single connection point. Often used as Generic Header-pin footprint for 0.1 inch spaced/style header connections On any of the 0.1 inch spaced packages, you can populate with these: Break Away Headers - Straight <https://www.sparkfun.com/products/116> (PRT-00116) Break Away Male Headers - Right Angle <https://www.sparkfun.com/products/553> (PRT-00553) Female Headers <https://www.sparkfun.com/products/115> (PRT-00115) Break Away Headers - Machine Pin <https://www.sparkfun.com/products/117> (PRT-00117) Break Away Female Headers - Swiss Machine Pin <https://www.sparkfun.com/products/743> (PRT-00743) This device is also useful as a general connection point to wire up your design to another part of your project. Our various solder wires solder well into these plated through hole pads. Hook-Up Wire - Assortment (Stranded, 22 AWG) <https://www.sparkfun.com/products/11375> (PRT-11375) Hook-Up Wire - Assortment (Solid Core, 22 AWG) <https://www.sparkfun.com/products/11367> (PRT-11367) View the entire wire category on our website here <https://www.sparkfun.com/categories/141> Special notes: SMTSO-256-ET is a "flush mount" nut for a 4-40 screw. We mostly use this on specialty testbeds; it is a nice way to connect hardware to your PCB at an adjustable hieght. Also note, the SNAP packages are for using a snappable style connector. We sell a baggie of snaps and they are also used on two LilyPad designs: Snap Assortment - 30 pack (male and female) <https://www.sparkfun.com/products/11347> (DEV-11347) LilyPad Arduino SimpleSnap <https://www.sparkfun.com/products/10941> (DEV-10941) LilyPad SimpleSnap Protoboard <https://www.sparkfun.com/products/10940> (DEV-10940)
J20 J21 = SparkFun-Connectors:CONN_02: Multi connection point. Often used as Generic Header-pin footprint for 0.1 inch spaced/style header connections On any of the 0.1 inch spaced packages, you can populate with these: Break Away Headers - Straight <https://www.sparkfun.com/products/116> (PRT-00116) Break Away Male Headers - Right Angle <https://www.sparkfun.com/products/553> (PRT-00553) Female Headers <https://www.sparkfun.com/products/115> (PRT-00115) Break Away Headers - Machine Pin <https://www.sparkfun.com/products/117> (PRT-00117) Break Away Female Headers - Swiss Machine Pin <https://www.sparkfun.com/products/743> (PRT-00743) For SCREWTERMINALS and SPRING TERMINALS visit here: Screw Terimnals on SparkFun.com <https://www.sparkfun.com/search/results?term=Screw+Terminals> (5mm/3.5mm/2.54mm spacing) This device is also useful as a general connection point to wire up your design to another part of your project. Our various solder wires solder well into these plated through hole pads. Hook-Up Wire - Assortment (Stranded, 22 AWG) <https://www.sparkfun.com/products/11375> (PRT-11375) Hook-Up Wire - Assortment (Solid Core, 22 AWG) <https://www.sparkfun.com/products/11367> (PRT-11367) View the entire wire category on our website here <https://www.sparkfun.com/categories/141> Special notes: Molex polarized connector foot print use with: PRT-08233 with associated crimp pins and housings. 2.54_SCREWTERM for use with PRT-10571. 3.5mm Screw Terminal footprints for PRT-08084 5mm Screw Terminal footprints for use with PRT-08432
L1 = inductors:82721K: FILTER
L2 = inductors:82114A: INDUCTOR; SPICEPREFIX: L
L3 L4 = rcl:L-EU: INDUCTOR, European symbol; SPICEPREFIX: L
Q1 = transistor-power:IRF9530: P-CHANNEL HEXFET POWER-MOS-FET Source: http://www.irf.com/product-info/datasheets/data/irf9530.pdf
R1-R3 R5-R15 R17-R27 R31-R54 = rcl:R-EU_: RESISTOR, European symbol; SPICEPREFIX: R
R4 = resistor-shunt:PMA-B: SMD SHUNT RESISTOR; OC_FARNELL: unknown; OC_NEWARK: unknown
R16 = rcl:R-TRIMM: Trimm resistor; SPICEMODEL: X; SPICEPREFIXL: POT
TP1-TP42 = testpad:TP: Test pad
U1 = SparkFun-IC-Special-Function:INA169: Current Output Current Shunt Monitor 0.5%, SOT23-5 Datasheet <http://cdn.sparkfun.com/datasheets/Sensors/Current/ina169.pdf> SparkFun Products SparkFun Current Sensor Breakout - INA169 <https://www.sparkfun.com/products/12040> (SEN-12040); PROD_ID: IC-11776; VALUE: INA169
U2 = Pascal_Library:L6234: The L6234 is a triple half bridge to drive a brushless DC motor.
X1 X4 = con-phoenix-508:MKDSN1,5/2-5,08: MKDSN 1,5/ 2-5,08 Printklemme Nennstrom: 13,5 A Nennspannung: 250 V Rastermaß: 5,08 mm Polzahl: 2 Anschlussart: Schraubanschluss Montage: Löten Anschlussrichtung Leiter/Platine: 0 ° Artikelnummer: 1729128 Source: http://eshop.phoenixcontact.com .. 1729128.pdf
X2 X3 = con-phoenix-508:MKDSN1,5/3-5,08: MKDSN 1,5/ 3-5,08 Printklemme Nennstrom: 13,5 A Nennspannung: 250 V Rastermaß: 5,08 mm Polzahl: 3 Anschlussart: Schraubanschluss Montage: Löten Anschlussrichtung Leiter/Platine: 0 ° Artikelnummer: 1729131 Source: http://eshop.phoenixcontact.com .. 1729131.pdf

## Board
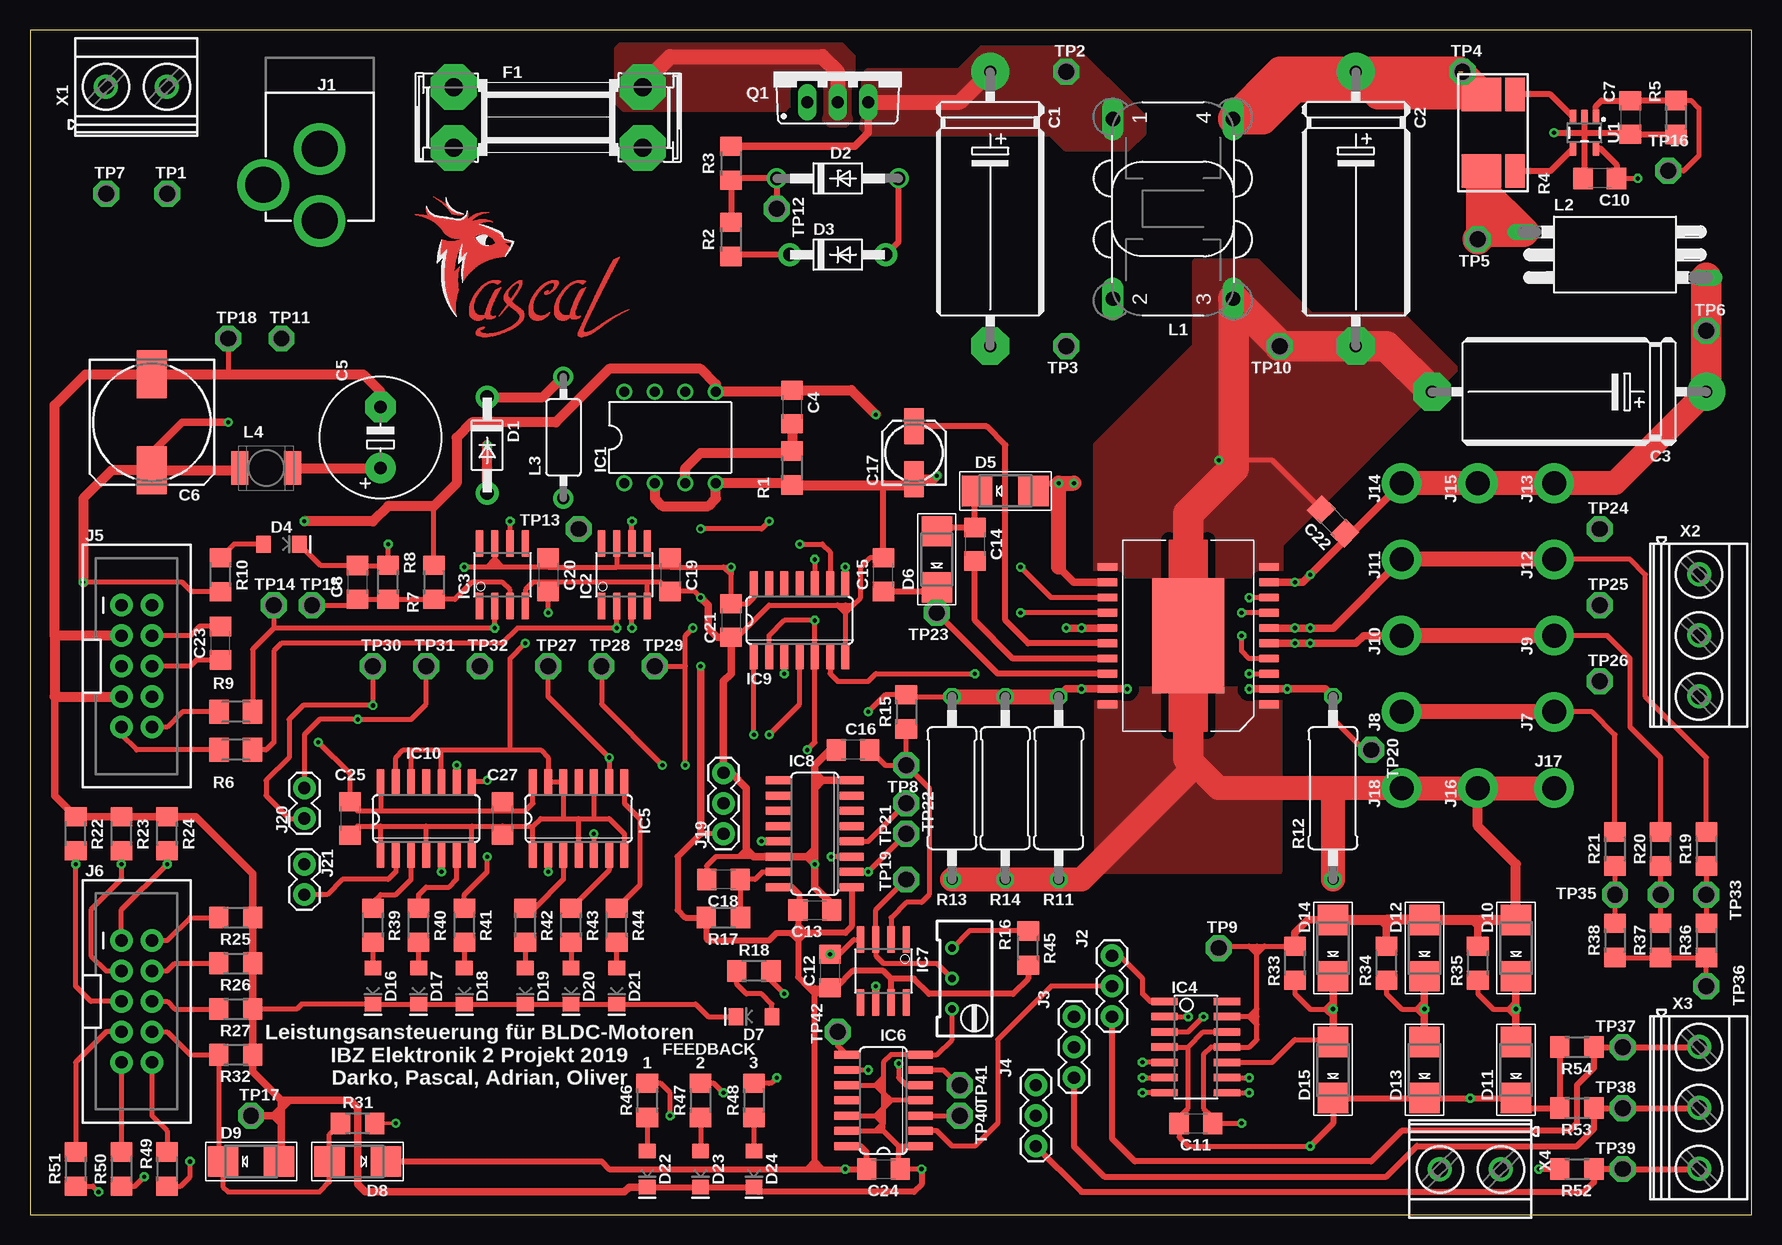
[diagram p6: board, top side]
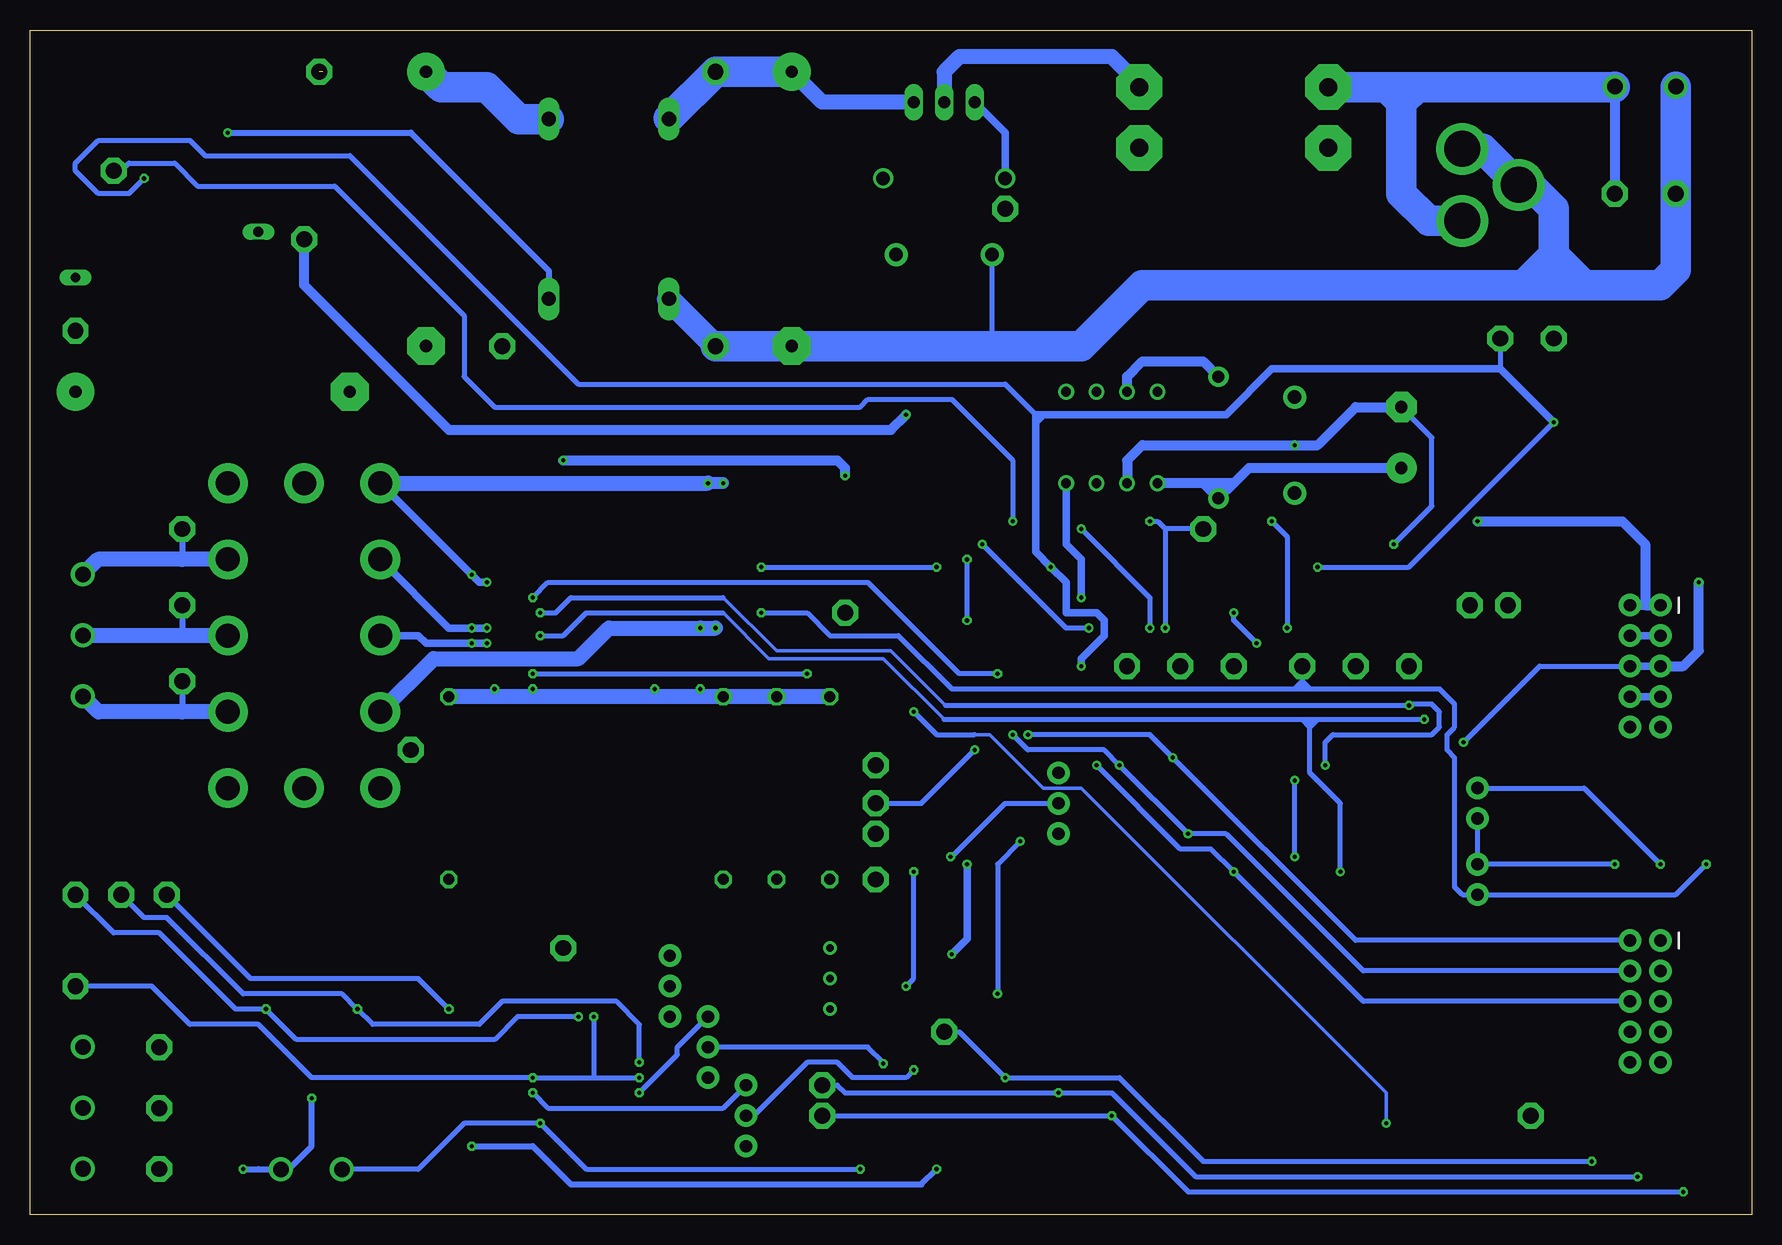
[diagram p7: board, bottom side, seen from below]

Size 143.49 x 98.73 mm. Coordinates in mm from the lower left corner, seen from the top.
Outline: 0,0 143.49,0 143.49,98.73 0,98.73 0,0
Copper layers (1*16): Top 0.035mm / dielectric 1.5mm / Bottom 0.035mm
Design rules "default": minimum track width 6mil, minimum drill 0.35mm, track to track 6mil, track to pad 6mil, pad to pad 6mil, via to via 6mil, smd to smd 6mil, copper to edge 40mil, drill to drill 6mil, minimum pad ring 10mil, minimum via ring 8mil, stop-mask expansion 4mil, vias tented up to drill 0mil, thermal gap 10mil

### Footprints (pad centres in the part's own frame; a part is rotated, then mirrored left to right if it is on the bottom)
E22-9 = drill 1.016 pad 3.15: + -11.43,0 | drill 1.016 pad 3.15 octagon: - 11.43,0
C1206 = smd 1.6 x 1.8: 1 -1.4,0; 2 1.4,0
E5-10,5 = drill 1.016 pad 2.54: + -2.54,0 | drill 1.016 pad 2.54 octagon: - 2.54,0
153CLV-1010 = smd 4 x 2.5: + 4,0; - -4,0
153CLV-0505 = smd 3 x 1.6: + 2.2,0; - -2.2,0
DO41-7 = drill 1.118 pad 1.93: A 4,0; C -4,0
DO41Z10 = drill 1.118: A 5.08,0; C -5.08,0
LED-1206 = smd 1.2 x 1.4: A -1.5,0; C 1.5,0
SMADIODE = smd 2.54 x 2.54: A 2.349,0; C -2.349,0
SHK20Q = drill 1.5 pad 3.81 octagon: 1A -7.874,2.54; 1B -7.874,-2.54; 2A 7.874,2.54; 2B 7.874,-2.54
DIL08 = drill 0.813 pad 1.27: 1 -3.81,-3.81; 2 -1.27,-3.81; 3 1.27,-3.81; 4 3.81,-3.81; 5 3.81,3.81; 6 1.27,3.81; 7 -1.27,3.81; 8 -3.81,3.81
SO08 = smd 0.61 x 2.21: 1 -1.905,-2.616; 2 -0.635,-2.616; 3 0.635,-2.616; 4 1.905,-2.616; 5 1.905,2.616; 6 0.635,2.616; 7 -0.635,2.616; 8 -1.905,2.616
SO14 = smd 0.61 x 2.21: 1 -3.81,-2.603; 2 -2.54,-2.603; 3 -1.27,-2.603; 4 0,-2.603; 5 1.27,-2.603; 6 2.54,-2.603; 7 3.81,-2.603; 8 3.81,2.603; 9 2.54,2.603; 10 1.27,2.603; 11 0,2.603; 12 -1.27,2.603; 13 -2.54,2.603; 14 -3.81,2.603
SO14' = smd 0.66 x 2.032: 1 -3.81,-3.073; 2 -2.54,-3.073; 3 -1.27,-3.073; 4 0,-3.073; 5 1.27,-3.073; 6 2.54,-3.073; 7 3.81,-3.073; 8 3.81,3.073; 9 2.54,3.073; 10 1.27,3.073; 11 0,3.073; 12 -1.27,3.073; 13 -2.54,3.073; 14 -3.81,3.073
SO16 = smd 0.66 x 2.032: 1 -4.445,-3.073; 2 -3.175,-3.073; 3 -1.905,-3.073; 4 -0.635,-3.073; 5 0.635,-3.073; 6 1.905,-3.073; 7 3.175,-3.073; 8 4.445,-3.073; 9 4.445,3.073; 10 3.175,3.073; 11 1.905,3.073; 12 0.635,3.073; 13 -0.635,3.073; 14 -1.905,3.073; 15 -3.175,3.073; 16 -4.445,3.073
POWER_JACK_PTH = drill 2.997 pad 4.318: GND 0,7.7; GNDBREAK 4.7,10.7; PWR 0,13.7
1X03 = drill 1.016 pad 1.88: 1 0,0; 2 2.54,0; 3 5.08,0
2X5-SHROUDED = drill 1.016 pad 1.88: 1 -1.27,5.08; 2 1.27,5.08; 3 -1.27,2.54; 4 1.27,2.54; 5 -1.27,0; 6 1.27,0; 7 -1.27,-2.54; 8 1.27,-2.54; 9 -1.27,-5.08; 10 1.27,-5.08
1X01_2MM = drill 2 pad 3.302: 1 0,0
1X02 = drill 1.016 pad 1.88: 1 0,0; 2 2.54,0
82721K = drill 1.194 long: 1 7.493,5.004; 2 -7.493,5.004; 3 -7.493,-5.004; 4 7.493,-5.004
82114A = drill 0.813 long: 1 -7.62,1.905; 2 7.62,-1.905
IR-2 = drill 1 pad 1.676: 1 -5.08,0; 2 5.08,0
L5038P = smd 1.4 x 2.8: 1 -2.2,0; 2 2.2,0
TO220BV = drill 1.016 long: D 0,-2.54; G -2.54,-2.54; S 2.54,-2.54
R1206 = smd 1.6 x 1.803: 1 -1.422,0; 2 1.422,0
PMA-B = smd 2.8 x 3.3: A 3.2,-0.965; B -3.2,-0.965 | smd 2.8 x 1.6: SA 3.2,1.829; SB -3.2,1.829
M1206 = smd 1.6 x 2: 1 -1.4,0; 2 1.4,0
0411/15 = drill 0.914 octagon: 1 -7.62,0; 2 7.62,0
RTRIM64W = drill 0.61: 1 1.27,-2.54; 2 1.27,0; 3 1.27,2.54
P1-13 = drill 1.321 pad 2.159 octagon: TP 0,0
SOT23-5 = smd 0.55 x 1.2: 1 -0.95,-1.3; 2 0,-1.3; 3 0.95,-1.3; 4 0.95,1.3; 5 -0.95,1.3
POWERSO20 = smd 1.651 x 0.635: 1 -6.731,5.715; 2 -6.731,4.445; 3 -6.731,3.175; 4 -6.731,1.905; 5 -6.731,0.635; 6 -6.731,-0.635; 7 -6.731,-1.905; 8 -6.731,-3.175; 9 -6.731,-4.445; 10 -6.731,-5.715; 11 6.731,-5.715; 12 6.731,-4.445; 13 6.731,-3.175; 14 6.731,-1.905; 15 6.731,-0.635; 16 6.731,0.635; 17 6.731,1.905; 18 6.731,3.175; 19 6.731,4.445; 20 6.731,5.715 | smd 5.994 x 9.601: PAD 0,0
MKDSN1,5/2-5,08 = drill 1.3 pad 2: 1 -2.561,0.025; 2 2.519,0.025
MKDSN1,5/3-5,08 = drill 1.3 pad 2: 1 -7.641,0.025; 2 -2.561,0.025; 3 2.519,0.025

### Placement (x,y rotation side)
C1  80.01,83.82 270 top
C2  110.49,83.82 270 top
C3  128.27,68.58 180 top
C4  63.5,67.31 270 top
C5  29.21,64.77 90 top
C6  10.16,66.04 270 top
C7  133.35,91.44 270 top
C8  27.3,52.7 90 top
C10  130.81,86.36 180 top
C11  97.16,7.62 0 top
C12  66.67,20.32 90 top
C13  65.41,25.4 0 top
C14  78.74,55.88 270 top
C15  71.12,53.34 90 top
C16  68.58,38.73 180 top
C17  73.66,63.5 90 top
C18  57.78,27.94 180 top
C19  53.34,53.34 270 top
C20  43.18,53.34 270 top
C21  58.42,49.53 270 top
C22  108.58,57.78 135 top
C23  15.88,47.62 90 top
C24  71.12,3.81 0 top
C25  26.67,33.02 270 top
C27  39.37,33.02 270 top
D1  38.1,64.14 270 top
D2  67.31,86.36 0 top
D3  67.31,80.01 0 top
D4  20.95,55.88 0 top
D5  81.28,60.33 0 top
D6  75.56,54.61 90 top
D7  60.33,16.51 180 top
D8  27.3,4.45 180 top
D9  18.41,4.45 0 top
D10  123.83,22.23 90 top
D11  123.83,12.06 90 top
D12  116.2,22.23 90 top
D13  116.2,12.06 90 top
D14  108.58,22.23 90 top
D15  108.58,12.06 90 top
D16  28.57,19.05 270 top
D17  32.38,19.05 270 top
D18  36.2,19.05 270 top
D19  41.27,19.05 270 top
D20  45.09,19.05 270 top
D21  48.9,19.05 270 top
D22  51.44,3.81 270 top
D23  55.88,3.81 270 top
D24  60.33,3.81 270 top
F1  43.18,91.44 0 top
IC1  53.34,64.77 0 top
IC2  49.53,53.34 0 top
IC3  39.37,53.34 0 top
IC4  97.16,13.97 270 top
IC5  74HC125D  [SO14']  45.72,33.02 0 top
IC6  74HC125D  [SO14']  71.12,9.53 90 top
IC7  71.12,20.32 180 top
IC8  65.41,31.75 90 top
IC9  74HC08D  [SO14']  64.14,49.53 0 top
IC10  74HC125D  [SO14']  33.02,33.02 0 top
J1  24.13,96.52 180 top
J2  90.17,21.59 270 top
J3  87,16.51 270 top
J4  83.82,10.79 270 top
J5  8.89,45.72 0 top
J6  8.89,17.78 0 top
J7  127,41.91 90 top
J8  114.3,41.91 90 top
J9  127,48.26 90 top
J10  114.3,48.26 90 top
J11  114.3,54.61 90 top
J12  127,54.61 90 top
J13  127,60.96 90 top
J14  114.3,60.96 90 top
J15  120.65,60.96 90 top
J16  120.65,35.56 90 top
J17  127,35.56 0 top
J18  114.3,35.56 90 top
J19  57.78,31.75 90 top
J20  22.86,33.02 90 top
J21  22.86,29.21 270 top
L1  95.25,83.82 90 top
L2  132.08,80.01 0 top
L3  44.45,64.77 90 top
L4  19.68,62.23 0 top
Q1  67.31,95.25 0 top
R1  63.5,62.23 90 top
R2  58.42,81.28 90 top
R3  58.42,87.63 90 top
R4  121.92,90.17 270 top
R5  137.16,91.44 90 top
R6  17.14,38.73 0 top
R7  33.66,52.7 90 top
R8  29.84,52.7 270 top
R9  17.14,41.91 0 top
R10  15.88,53.34 270 top
R11  85.72,35.56 90 top
R12  108.58,35.56 90 top
R13  76.83,35.56 90 top
R14  81.28,35.56 90 top
R15  73.03,41.91 90 top
R16  78.11,19.68 180 top
R17  57.78,24.77 180 top
R18  60.33,20.32 0 top
R19  139.7,30.48 90 top
R20  135.89,30.48 90 top
R21  132.08,30.48 90 top
R22  3.81,31.75 270 top
R23  7.62,31.75 270 top
R24  11.43,31.75 270 top
R25  17.14,24.77 180 top
R26  17.14,20.95 180 top
R27  17.14,17.14 180 top
R31  27.3,7.62 0 top
R32  17.14,13.34 180 top
R33  105.41,20.95 270 top
R34  113.03,20.95 270 top
R35  120.65,20.95 270 top
R36  139.7,22.86 90 top
R37  135.89,22.86 90 top
R38  132.08,22.86 90 top
R39  28.57,24.13 270 top
R40  32.38,24.13 270 top
R41  36.2,24.13 270 top
R42  41.27,24.13 270 top
R43  45.09,24.13 270 top
R44  48.9,24.13 270 top
R45  83.19,22.23 270 top
R46  51.44,9.53 90 top
R47  55.88,9.53 90 top
R48  60.33,9.53 90 top
R49  11.43,3.81 90 top
R50  7.62,3.81 90 top
R51  3.81,3.81 90 top
R52  128.91,3.81 180 top
R53  128.91,8.89 180 top
R54  128.91,13.97 180 top
TP1  11.43,85.09 0 top
TP2  86.36,95.25 0 top
TP3  86.36,72.39 180 top
TP4  119.38,95.25 0 top
TP5  120.65,81.28 180 top
TP6  139.7,73.66 0 top
TP7  6.35,85.09 0 top
TP8  73.03,37.47 180 top
TP9  99.06,22.23 0 top
TP10  104.14,72.39 180 top
TP11  20.95,73.03 0 top
TP12  62.23,83.82 270 top
TP13  45.72,57.15 0 top
TP14  20.32,50.8 0 top
TP15  23.5,50.8 0 top
TP16  136.53,87 0 top
TP17  18.41,8.26 0 top
TP18  16.51,73.03 0 top
TP19  73.03,27.94 90 top
TP20  111.76,38.73 270 top
TP21  73.03,31.75 90 top
TP22  73.03,34.29 270 top
TP23  75.56,50.16 180 top
TP24  130.81,57.15 0 top
TP25  130.81,50.8 0 top
TP26  130.81,44.45 0 top
TP27  43.18,45.72 0 top
TP28  47.62,45.72 0 top
TP29  52.07,45.72 0 top
TP30  28.57,45.72 0 top
TP31  33.02,45.72 0 top
TP32  37.47,45.72 0 top
TP33  139.7,26.67 180 top
TP34  135.89,26.67 180 top
TP35  132.08,26.67 180 top
TP36  139.7,19.05 90 top
TP37  132.72,13.97 0 top
TP38  132.72,8.89 0 top
TP39  132.72,3.81 270 top
TP40  77.47,8.26 270 top
TP41  77.47,10.79 270 top
TP42  67.31,15.24 90 top
U1  129.54,90.17 180 top
U2  96.52,48.26 180 top
X1  8.89,93.98 0 top
X2  139.06,45.72 270 top
X3  139.06,6.35 270 top
X4  120.02,3.81 180 top

### Tracks (layer width: path | path; a pad name or v marks a point on that pad's centre or on a via)
+5V  (via drill 0.35)
  Top 0.406: IC4.4 96.52,13.97 | 96.52,13.97 96.52,8.89 95.75,8.12 C11.1 95.75,6.48 96.52,5.71 v106.68,5.71 | IC4.12 97.79,15.24 96.52,13.97 | C10.1 v133.99,86.36 | IC3.7 38.73,54.61 | 38.73,54.61 39.37,53.98 | 43.18,53.98 39.37,53.98 | 43.18,53.98 48.9,53.98 | IC2.7 48.9,53.98 | C20.1 43.18,53.98 | IC9.14 60.33,51.44 59.82,50.93 C21.1 58.42,53.34 | 67.18,18.92 C12.1 | C13.1 64,25.91 64.14,26.04 | 64,23.5 64,24 64,24.13 | 64,23.5 64,22.86 | 64.9,18.92 65.41,18.92 | 65.41,18.92 66.04,18.92 | 65.41,18.92 65.41,18.41 65.53,18.41 | 64.64,23.5 64,23.5 | 64,23.5 63.5,23.5 63.5,23.36 | J19.1 55.88,31.75 | 39.37,53.98 38.73,53.98 | 38.73,53.98 38.1,53.98 | 38.1,53.98 v36.2,53.98 | 38.1,53.98 38.73,54.61 | 38.73,53.98 38.73,54.61 | C23.1 13.84,46.23 13.34,45.72 J5.6 | R10.2 13.49,51.92 12.7,52.7 4.45,52.7 v4.42,52.7 | IC5.14 41.91,34.29 41.27,33.66 39.37,33.66 | 29.21,33.66 27.3,33.66 27.3,33.78 C25.1 26.67,36.73 v24.03,39.37 | 29.21,33.66 39.37,33.66 | C27.1 39.37,33.66 | IC10.14 29.21,33.66 | 53.34,53.98 48.9,53.98 | C19.1 53.34,53.98 | 53.34,53.98 57.78,53.98 | 58.42,53.34 57.78,53.98 | 57.78,53.98 v58.42,53.98 58.42,53.34
  Top 0.508: U1.5 130.84,88.87 132.21,87.5 C10.1 | R54.2 R53.2 124.65,8.89 D11.C v120.02,9.72 D13.C D15.C 108.58,7.62 v106.68,5.71 | R52.2 v125.73,3.81 | IC6.14 69.22,5.71 69.72,5.21 C24.1 v67.94,3.81 66.04,3.81 | IC7.7 71.75,19.68 | 71.75,19.68 71.12,20.32 68.58,20.32 67.18,18.92 | 71.75,19.68 73.66,19.68 74.93,18.41 81.92,18.41 83.19,19.68 R45.2 | 66.04,3.81 65.41,4.45 | IC8.1 68.48,24.03 67.94,23.5 64.64,23.5 | 64.14,26.04 64.14,26.67 63.5,27.3 IC8.16 | C13.1 64,24.13 64.64,23.5 | 64,22.86 64,19.82 64.9,18.92 65.41,18.41 65.41,4.45 | C12.1 66.04,18.92 65.53,18.41 | 64.64,23.5 64,22.86 | 64,24 63.5,23.5 62.23,23.5 61.59,22.86 56.52,22.86 56.36,23.01 R17.2 54.61,24.77 53.98,25.4 53.98,29.84 55.88,31.75 | 63.5,23.36 64,22.86 | D8.C 47.62,4.45 48.26,3.81 64.77,3.81 | 64.77,3.81 65.41,3.81 | 65.41,3.81 66.04,3.81 | 65.41,4.45 64.77,3.81 | 65.41,4.45 65.41,3.81
  Top 0.61: v55.88,45.72 55.88,31.75 | C6.+ 10.16,63.5 12.7,66.04 v16.51,66.04
  Top 0.813: L4.1 17.68,62.04 C6.+ 6.79,62.04 4.45,59.69 4.45,52.7
  Bottom 0.406: v133.99,86.36 135.25,85.09 137.79,85.09 139.7,87 139.7,87.63 137.79,89.53 130.18,89.53 128.91,88.27 116.84,88.27 97.79,69.22 62.23,69.22 59.69,66.67 | v36.2,53.98 28.57,53.98 v16.51,66.04 | v24.03,39.37 17.68,45.72 J5.6 | TP11.TP 20.95,70.48 | X4.1 124.44,3.79 124.46,3.81
  Bottom 0.508: v125.73,3.81 124.46,3.81 121.92,3.81 120.02,5.71 v120.02,9.72 | v106.68,5.71 101.6,5.71 98.42,2.54 69.22,2.54 v67.94,3.81
  Bottom 0.61: J5.5 J5.6 | 59.05,66.67 43.81,66.67 40.01,70.48 20.95,70.48 v16.51,66.04 | 59.05,66.67 59.69,66.67 59.69,66.04 | 59.05,66.67 59.69,66.04 | 59.69,66.04 59.69,55.24 v58.42,53.98 57.15,52.7 57.15,50.16 54.61,50.16 53.98,49.53 53.98,48.26 55.88,46.35 v55.88,45.72
  Bottom 0.813: J5.5 5.71,45.72 4.42,47.02 v4.42,52.7
EN1  (via drill 0.35)
  Top 0.406: J6.2 11.43,22.86 13.34,24.77 R25.2 | IC5.9 v48.26,38.1 43.18,43.18 TP27.TP | v60.33,40.01 IC9.1
  Bottom 0.406: J6.2 33.02,22.86 v48.26,38.1 50.16,40.01 v60.33,40.01
EN2  (via drill 0.35)
  Top 0.406: J6.4 11.43,20.32 12.06,20.95 R26.2 | v46.99,31.75 IC5.5 | v61.59,40.01 64.14,42.55 IC9.4 | TP28.TP 47.62,42.55 v52.7,37.47
  Bottom 0.406: J6.4 32.38,20.32 43.81,31.75 v46.99,31.75 v52.7,37.47 53.98,38.73 60.33,38.73 v61.59,40.01
EN3  (via drill 0.35)
  Top 0.406: J6.6 11.43,17.78 12.06,17.14 R27.2 | v43.18,28.57 IC5.2 | v54.61,37.47 54.61,45.72 | 54.61,45.72 54.61,48.26 v55.24,48.9 | v64.14,55.88 66.04,55.88 66.67,55.24 IC9.9 | TP29.TP 54.61,45.72
  Bottom 0.406: J6.6 32.38,17.78 v43.18,28.57 45.09,30.48 47.62,30.48 v54.61,37.47 | v55.24,48.9 57.15,48.9 v64.14,55.88
FEEDBACK1
  Top 0.406: J2.2 85.09,19.05 80.64,14.61 80.64,7.62 78.74,5.71 76.83,5.71 75.56,6.99 IC6.2
FEEDBACK2  (via drill 0.35)
  Top 0.406: v72.39,12.6 72.39,11.43 73.03,10.79 IC6.5
  Bottom 0.406: J3.2 73.66,13.97 72.39,12.7 v72.39,12.6
FEEDBACK3  (via drill 0.35)
  Top 0.406: IC6.9 v69.85,12.06
  Bottom 0.406: v69.85,12.06 70.48,11.43 74.93,11.43 76.2,12.7 78.74,12.7 83.19,8.26 J4.2
GND  (via drill 0.35)
  Top 0.406: 102.23,15.88 102.23,14.61 101.6,13.97 IC4.11 98.42,13.97 97.79,13.34 97.79,8.89 98.42,8.26 98.42,7.75 C11.2 v100.97,7.62 | 102.23,15.88 102.23,16.51 | 102.23,16.51 101.6,16.51 | 101.6,16.51 IC4.13 | IC3.4 41.27,52.07 41.91,52.7 43.18,52.7 | 51.44,52.7 52.58,52.7 C19.2 55.38,51.94 v55.88,51.44 | 51.44,52.7 43.18,52.7 | 43.18,52.7 C20.2 v43.18,50.16 | 67.94,50.16 IC9.7 | C22.2 103.5,62.87 v99.06,62.87 | 71.12,11.43 71.12,12.7 71.75,13.34 IC6.7 75.56,13.34 76.83,14.61 R16.3 | 71.12,11.43 71.12,10.79 | 71.12,10.79 71.12,10.16 | 71.12,10.16 71.12,9.53 | 71.12,9.53 71.12,8.89 | 71.12,8.89 71.12,8.26 | 71.12,8.26 71.12,7.62 | 71.12,6.99 71.12,7.62 | IC6.13 70.48,6.99 | 70.48,6.99 71.12,6.99 | IC6.12 70.48,8.26 | 71.12,8.26 70.48,8.26 | IC6.10 70.48,10.79 | 71.12,10.79 70.48,10.79 | IC6.4 71.75,9.53 | 71.12,9.53 71.75,9.53 | IC6.1 73.03,5.71 | 73.03,5.71 72.39,5.71 | 72.39,5.71 71.12,6.99 | 72.39,5.08 72.39,3.94 C24.2 v74.3,3.81 | 72.39,5.08 72.39,5.71 | C12.2 67.44,21.72 68.66,22.94 IC7.4 | C13.2 66.81,25.91 | 65.41,36.2 66.04,36.2 | 70.48,10.79 71.12,11.43 | 70.48,10.79 71.12,10.16 | 71.12,10.16 71.75,9.53 | 71.75,9.53 71.12,8.89 | 70.48,8.26 71.12,8.89 | 70.48,8.26 71.12,7.62 | 71.12,7.62 70.48,6.99 | 72.39,5.08 73.03,5.71 | 112.39,24.57 113.03,23.94 | 113.67,24.57 113.03,23.94 | 113.03,23.94 113.03,23.5 | 120.02,24.57 120.65,23.94 | 121.28,24.57 120.65,23.94 | 120.65,23.94 120.65,23.5 | 59.69,29.84 59.05,29.84 | 59.05,29.84 57.15,29.84 56.38,29.08 C18.2 | 59.69,29.84 59.69,30.48 59.05,29.84 | 60.33,29.84 59.69,29.84 | C21.2 58.92,48.13 61.59,50.8 67.31,50.8 | 67.31,50.8 67.94,50.8 | 67.94,50.8 68.58,50.8 | C15.2 69.98,54.74 69.22,53.98 69.22,51.44 68.58,50.8
  Top 0.406: 68.58,50.8 67.94,50.16 | 67.31,50.8 67.94,50.16 | v29.84,55.88 R8.1 29.82,54.1 C8.2 24.23,54.1 D4.C | C16.2 66.67,38.73 | C23.2 14.1,49.02 13.34,48.26 J5.4 | 27.3,32.38 27.3,32.26 C25.2 27.43,32.38 29.21,32.38 | 29.21,32.38 33.02,32.38 | 33.02,32.38 36.83,32.38 | 36.83,32.38 39.37,32.38 | 39.37,32.38 41.91,32.38 | 44.45,33.02 42.55,33.02 41.91,32.38 | 44.45,33.02 45.72,33.02 | 45.72,33.02 46.99,33.02 | 46.99,33.02 48.26,33.02 49.53,31.75 IC5.7 | IC5.1 41.91,32.38 | C27.2 39.37,32.38 | 44.45,33.02 IC5.12 IC5.13 43.18,38.1 42.55,38.73 40.01,38.73 | IC5.10 46.99,33.02 | IC10.4 33.02,32.38 | IC10.13 30.48,38.1 31.11,38.73 31.75,38.73 | 31.75,38.73 34.29,38.73 | 34.29,38.73 40.01,38.73 | IC10.10 34.29,38.73 | IC10.12 31.75,38.73 | IC10.1 29.21,32.38 | IC10.7 36.83,32.38 | IC5.4 45.72,33.02 | TP9.TP 99.21,22.38 101.6,22.38 | 101.6,22.38 102.23,22.38 | 102.23,22.38 102.87,22.38 | 102.87,22.38 R33.1 | 102.23,16.51 102.23,17.14 | 102.23,17.14 102.23,21.74 | 102.23,21.74 102.23,22.38 | 102.23,17.14 101.6,16.51 | 101.6,16.51 102.23,15.88 | 101.6,22.38 102.23,21.74 | 102.23,21.74 102.87,22.38 | D7.C 56.52,16.51 55.48,17.55 D21.C D20.C D19.C D18.C D17.C D16.C 22.63,17.55 22.23,17.14 R27.1 | IC2.4 51.44,52.7 | 67.94,50.8 67.94,50.16 | 40.01,38.73 40.01,46.35 v41.27,47.62 | TP18.TP 16.51,70.04
  Top 0.508: U1.2 129.54,90.17 | v127,90.17 129.54,90.17 | R5.1 133.37,90.02 C7.2 133.22,90.17 129.54,90.17 | 129.54,90.17 129.54,86.36 C10.2 | D22.C D23.C D24.C 60.73,1.91 73.66,1.91 74.3,2.54 v74.3,3.81 | C15.2 71.12,60.81
  Top 0.61: R33.1 105.41,23.5 106.49,24.57 D14.A | R34.1 113.03,23.5 113.03,24.57 | R35.1 120.65,23.5 120.65,24.57 | 66.81,25.91 65.41,27.3 v65.41,29.21 | v65.41,29.21 65.41,29.84 | 65.41,29.84 65.41,30.48 | 65.41,30.48 65.41,35.56 | 65.41,35.56 65.41,36.2 65.41,36.83 | 66.04,36.2 IC8.8 | 64.77,29.84 IC8.14 60.33,29.84 59.69,30.48 59.69,35.56 58.42,36.83 J19.3 57.78,44.45 58.42,45.09 C21.2 57.28,48.13 56.52,48.9 56.52,50.8 v55.88,51.44 | 65.41,29.84 64.77,29.84 | 20.95,9.53 18.57,11.91 R32.1 R27.1 R26.1 R25.1 18.57,28.42 13.82,33.17 R24.1 R23.1 R22.1 2.06,34.92 2.06,43.18 | 64.77,29.84 65.41,30.48 | 64.77,29.84 v65.41,29.21 | 66.67,38.73 65.41,37.47 65.41,36.83 | 65.41,36.83 66.04,36.2 | 66.04,36.2 65.41,35.56 | D22.C 49.94,2.31 49.53,1.91 27.94,1.91 27.3,2.54 27.3,8.89 26.67,9.53 21.59,9.53 | 21.59,9.53 20.95,9.53 | D9.A 20.77,4.89 20.95,5.08 20.95,7.62 | 20.95,7.62 20.95,8.26 | 20.95,8.26 20.95,8.89 | 20.95,8.89 20.95,9.53 | 20.95,8.89 21.59,9.53 | TP17.TP 20.32,8.26 | 20.95,8.26 20.32,8.26 | 20.32,8.26 20.95,8.89 | 20.32,8.26 20.95,7.62
  Top 0.813: C5.- 29.21,68.58 27.75,70.04 16.51,70.04 C6.- 4.63,70.04 2.06,67.46 2.06,48.26 | D14.A 112.39,24.57 113.03,24.57 113.67,24.57 D12.A 120.02,24.57 120.65,24.57 121.28,24.57 D10.A 123.83,29.21 120.65,32.38 J16.1 | v75.56,61.59 75.27,61.3 C17.- 73.17,60.81 71.12,60.81 R1.1 63.37,60.96 IC1.4 57.15,59.69 56.52,59.05 52.7,59.05 52.07,59.69 IC1.2 | J5.7 2.06,43.18 2.06,48.26 | J5.3 2.06,48.26 | D1.A v38.1,64.14
  Top 2: J17.1 J16.1 J18.1 108.58,35.56 | 108.58,35.56 99.06,35.56 96.52,38.1 96.52,36.83 87.63,27.94 R11.1 R14.1 R13.1 | R12.1 108.58,35.56
  Top 2.54: 96.52,38.1 U2.PAD 96.52,58.42 100.33,62.23 100.33,76.25 L1.3 104.14,72.44 TP10.TP C2.- 113.03,72.39 C3.-
  Bottom 0.406: v74.3,3.81 97.16,3.81 v100.97,7.62 107.31,7.62 111.15,3.79 X4.2 | v29.84,55.88 26.67,59.05 26.67,64.77 C5.- | v41.27,47.62 43.18,49.53 v43.18,50.16
  Bottom 0.508: v127,90.17 111.76,90.17 100.25,78.66 L1.3
  Bottom 0.61: J5.4 J5.3 | J5.8 J5.7 | IC1.4 57.15,55.88 55.88,54.61 v55.88,51.44 | v65.41,29.21 65.41,22.99 C12.2
  Bottom 0.813: C5.- 33.02,67.31 36.2,64.14 v38.1,64.14 50.8,64.14 52.07,62.87 IC1.2 | v99.06,62.87 76.2,62.87 75.56,62.23 v75.56,61.59
  other vias: 66.67,21.72
  pour Top (isolate 0.61, no thermals): 88.9,43.81 104.14,43.81 104.14,28.57 88.9,28.57
  pour Top (isolate 0.61, no thermals): 88.9,53.34 88.9,64.14 97.16,72.39 97.16,79.38 102.23,79.38 106.68,74.93 114.3,74.93 118.75,70.48 104.14,55.88 104.14,53.34
I+
  Top 0.508: U1.3 126.69,93.37 R4.SB
I-
  Top 0.508: U1.4 126.69,86.97 R4.SA
I_OUT  (via drill 0.35)
  Top 0.406: IC2.6 v50.16,57.78 | IC2.2 v48.9,48.9 40.64,48.9 39.37,47.62 20.95,47.62 20.32,46.99 20.32,39.37 19.68,38.73 R6.2
  Bottom 0.406: v50.16,57.78 49.53,57.78 48.9,57.15 | 48.9,57.15 v48.9,48.9 | TP13.TP 48.9,57.15
MOTOR_I  (via drill 0.35)
  Top 0.305: v30.48,7.62 R31.2
  Top 0.406: R13.2 73.66,43.18 73.51,43.33 R15.2 71.27,43.33 v69.85,41.91 | TP20.TP 111.12,38.73 108.58,41.27 R12.2
  Top 0.61: R12.2 107.95,43.81 v104.78,43.81 U2.2 v101.6,43.81 | R11.2 86.36,43.81 v87.63,43.81 U2.19 v91.44,43.81
  Top 1.27: R13.2 R14.2 R11.2
  Bottom 0.305: 64.77,40.01 63.5,40.01 59.05,35.56 55.88,35.56 30.48,10.16 v30.48,7.62
  Bottom 0.406: v69.85,41.91 67.94,40.01 64.77,40.01
  Bottom 0.61: v91.44,43.81 91.44,43.18 | v87.63,43.81 87.63,43.18 | v101.6,43.81 101.6,43.18 | v104.78,43.81 104.78,43.18
  Bottom 1.27: R13.2 R14.2 R11.2 87.63,43.18 91.44,43.18 101.6,43.18 104.78,43.18 R12.2
MOTOR_OC  (via drill 0.35)
  Top 0.406: IC8.13 v60.96,31.11 | v62.87,18.41 61.75,19.53 R18.2
  Bottom 0.406: v60.96,31.11 62.87,29.21 v62.87,18.41
N$1
  Top 0.508: R2.1 58.55,80.01 D3.C
  Bottom 0.406: 63.5,72.39 63.31,72.58 D3.C
  Bottom 2: TP3.TP 90.25,76.28 L1.2
  Bottom 2.54: X1.1 6.35,93.98 TP7.TP 6.35,78.74 7.62,77.47 13.97,77.47 | J1.GND 22.43,88.82 J1.GNDBREAK 18.51,85.82 16.51,83.82 16.51,80.01 | TP3.TP C1.- 63.5,72.39 55.88,72.39 50.8,77.47 19.05,77.47 | 13.97,77.47 16.51,80.01 | 16.51,80.01 19.05,77.47 | 13.97,77.47 19.05,77.47
N$2
  Top 0.508: R3.2 58.55,88.9
  Top 0.61: R3.2 68.71,89.03 69.85,90.17 Q1.S
  Top 1.27: Q1.S 77.47,92.71 C1.+
  Bottom 1.27: Q1.S 77.47,92.71 C1.+
  Bottom 2: 90.25,91.36 L1.1
  Bottom 2.54: 86.31,95.25 C1.+ | TP2.TP 90.25,91.36
  pour Top (isolate 1.27, no thermals): 91.44,88.9 92.71,90.17 92.71,91.44 86.36,97.79 80.01,97.79 77.47,95.25 69.85,95.25 68.58,93.98 68.58,91.44 69.85,90.17 85.09,90.17 86.36,88.9
N$3  (1 unrouted)
  Top 2.54: C2.+ 119.08,95.25 R4.B 112.37,93.37 111.76,93.98 | C2.+ 111.76,93.98 | 100.25,91.36 L1.4 | L1.4 102.74,91.31 105.41,93.98 111.76,93.98 | L1.4 104.19,95.25 C2.+
  Bottom 2.54: L1.4 102.74,91.31 105.41,93.98 109.22,93.98 C2.+
N$4
  Top 0.813: IC1.3 54.61,62.23 55.88,63.5 63.5,63.5 R1.2 C4.2
N$5
  Top 0.813: L4.2 C5.+
  Bottom 0.813: C5.+ 41.91,62.23 43.18,60.96 | 43.18,60.96 44.45,60.96 | 44.45,60.96 45.72,60.96 | 45.72,60.96 IC1.1 | L3.1 45.72,60.96 | L3.1 43.18,60.96 | L3.1 44.45,60.96
N$6
  Top 0.813: D1.C 42.73,68.14 L3.2
  Bottom 0.813: IC1.7 52.07,69.85 50.8,71.12 45.72,71.12 L3.2
N$7
  Top 1.27: F1.2A 51.05,94.23 53.34,96.52 66.04,96.52 67.31,95.25 Q1.D
  Bottom 1.27: F1.2A 51.05,94.23 53.34,96.52 66.04,96.52 67.31,95.25 Q1.D
  pour Top (isolate 0.61, no thermals): 62.87,92.08 49.53,92.08 48.9,92.71 48.9,97.16 49.53,97.79 67.31,97.79 68.58,96.52 68.58,91.44 67.94,90.81 66.67,90.81 66.04,91.44 66.04,93.98 65.41,94.61 64.14,94.61 63.5,93.98 63.5,92.71
N$8
  Top 0.508: R2.2 R3.1 58.55,86.36 D2.C TP12.TP
  Bottom 0.61: D2.C 62.23,90.17 Q1.G
N$9
  Top 0.508: D3.A 72.39,81.09 D2.A
N$10  (via drill 0.35)
  Top 0.406: R5.2 138.43,92.86 139.06,92.23 139.06,88.27 137.79,87 TP16.TP | v50.16,48.9 IC2.3 | v61.59,57.78 60.96,57.15 v55.88,57.15
  Top 0.508: R5.2 137.14,92.84 C7.1 130.94,92.84 130.49,92.39 U1.1
  Bottom 0.406: TP16.TP 135.89,87 135.25,87.63 131.44,87.63 129.54,85.72 118.11,85.72 107.31,74.93 107.31,69.85 104.78,67.31 74.3,67.31 73.66,67.94 66.67,67.94 61.59,62.87 v61.59,57.78 | v50.16,48.9 50.16,51.44 v55.88,57.15
N$11
  Top 0.406: D4.A 16.99,55.88 R10.1
N$12
  Top 0.406: R6.1 8.89,38.73 7.62,40.01 J5.9
N$13
  Top 0.406: IC3.3 40.01,52.07 39.37,52.7 36.83,52.7 35.41,51.28 R7.1 R8.2 29.82,51.3 C8.1 26.8,50.8 TP15.TP
N$14
  Top 0.406: R9.1 12.7,41.91 11.43,40.64 J5.10
N$15
  Top 0.508: D6.A 75.89,57.28 C14.1 78.74,60.13 D5.C
N$16  (via drill 0.4)
  Top 0.406: R21.1 TP35.TP R38.2 | R33.2 105.41,18.41 106.68,17.14 107.95,17.14 | v108.58,17.14 107.95,17.14 | IC4.10 103.5,12.7 105.41,14.61 108.39,14.61 D15.A | 107.95,17.14 108.58,17.78 | 107.95,17.14 108.58,16.51
  Top 0.61: D15.A 108.58,16.51 v108.58,17.14 108.58,17.78 D14.C
  Bottom 0.406: v108.58,17.14 111.12,19.68 125.09,19.68 TP35.TP
N$17  (via drill 0.35, 0.4)
  Top 0.406: R19.1 TP33.TP R36.2 | R35.2 120.65,18.41 121.92,17.14 123.19,17.14 | v123.83,17.14 123.19,17.14 | IC4.3 96.52,15.24 v97.79,16.51 | 123.83,17.78 123.19,17.14 | 123.19,17.14 123.83,16.51
  Top 0.61: D11.A 123.83,16.51 v123.83,17.14 123.83,17.78 D10.C
  Bottom 0.406: TP33.TP 136.53,23.5 132.72,23.5 126.36,17.14 v123.83,17.14 121.28,14.61 104.78,14.61 102.87,16.51 v97.79,16.51
N$18  (via drill 0.35)
  Top 0.406: U2.8 v101.6,51.44 | v62.87,45.09 IC9.3
  Bottom 0.406: v62.87,45.09 66.04,45.09 73.66,52.7 100.33,52.7 v101.6,51.44
N$19
  Top 0.508: U2.18 80.64,45.09 TP23.TP D6.C 75.25,51.94 C15.1
N$20  (via drill 0.35, 0.4)
  Top 0.406: R37.2 TP34.TP R20.1 | R34.2 113.03,18.41 114.3,17.14 115.57,17.14 | v116.2,17.14 115.57,17.14 | IC4.5 v92.71,12.7 | 115.57,17.14 116.2,17.78 | 115.57,17.14 116.2,16.51
  Top 0.61: D12.C 116.2,17.78 v116.2,17.14 116.2,16.51 D13.A
  Bottom 0.406: TP34.TP 133.99,24.77 132.08,24.77 125.73,18.41 117.47,18.41 v116.2,17.14 114.94,15.88 106.05,15.88 104.14,17.78 94.61,17.78 92.71,15.88 v92.71,12.7
N$21
  Top 0.508: U2.17 81.92,46.35 78.74,49.53 C14.2
N$22
  Top 0.508: U2.16 83.19,47.62 81.28,49.53 81.28,64.14 79.72,65.7 C17.+
N$23
  Top 0.406: D7.A 61.83,17.55 60.96,18.41 59.69,18.41 58.9,19.2 R18.1
N$24  (via drill 0.35)
  Top 0.406: v101.6,45.09 U2.3 | v78.74,45.09 70.48,45.09 69.85,44.45 67.31,44.45 66.67,45.09 IC9.6
  Bottom 0.406: v101.6,45.09 v78.74,45.09
N$25  (via drill 0.35)
  Top 0.406: U2.13 85.09,51.44 v82.55,53.98 | v67.94,53.98 IC9.8
  Bottom 0.406: v82.55,53.98 v67.94,53.98
N$26
  Top 0.406: TP8.TP 74.93,35.56 74.93,26.67 74.3,26.04 73.03,26.04 71.75,24.77 IC7.2 | TP8.TP R15.1 | C16.1 71.25,37.47 TP8.TP
N$27  (via drill 0.35)
  Top 0.406: IC8.4 69.85,31.11 TP22.TP | IC9.2 61.59,48.26 62.87,49.53 v65.41,49.53 IC9.5 65.41,39.37 v64.77,38.73 | v65.41,54.61 IC9.10
  Bottom 0.406: v65.41,49.53 v65.41,54.61 | TP22.TP 69.22,34.29 v64.77,38.73
N$28  (via drill 0.35)
  Top 0.406: IC7.6 v70.48,19.05 | IC8.2 v69.85,28.57 TP21.TP
  Bottom 0.406: v70.48,19.05 69.85,19.68 v69.85,28.57
N$29
  Top 0.406: R17.1 59.19,24.79 C18.1 60.43,27.94 61.06,28.57 IC8.15
N$30  (via drill 0.35)
  Top 0.406: IC8.3 v66.77,29.84
  Bottom 0.406: v66.77,29.84 66.67,29.84 62.23,34.29 J19.2
N$31
  Top 0.406: R16.2 75.56,20.95 71.12,20.95 70.48,21.59 IC7.3 70.48,25.4 TP19.TP
N$32
  Top 0.406: IC4.1 93.34,17.78 92.71,18.41 92.71,19.68 90.81,21.59 J2.1
N$33
  Top 0.406: J6.8 11.43,15.24 13.34,13.34 R32.2 15.72,4.79 D9.C 16.07,2.35 16.51,1.91 24.13,1.91 24.96,2.73 D8.A 24.96,6.69 R31.1
N$34  (via drill 0.35)
  Top 0.406: R38.1 R37.1 R36.1 TP36.TP | IC4.9 v101.6,11.43 | v92.71,11.43 IC4.6 | IC4.2 v96.52,16.51
  Bottom 0.406: 96.52,11.43 v101.6,11.43 120.02,11.43 124.46,15.88 130.18,15.88 133.35,19.05 TP36.TP | 96.52,11.43 v92.71,11.43 | v96.52,16.51 96.52,11.43
N$35  (via drill 0.35)
  Top 0.406: IC4.7 v92.71,10.16
  Bottom 0.406: v92.71,10.16 89.53,13.34 89.53,13.97 J3.1
N$36  (via drill 0.35)
  Top 0.406: IC4.8 v101.6,10.16
  Bottom 0.406: v101.6,10.16 100.33,8.89 85.72,8.89 J4.1
N$37
  Top 0.406: R45.1 78.26,23.65 R16.1
N$38
  Top 0.406: R39.1 28.57,26.04 29.21,26.67 30.48,26.67 31.75,27.94 IC10.3
N$39
  Top 0.406: R40.1 32.38,26.67 33.02,27.3 34.92,27.3 35.56,27.94 IC10.6
N$40  (via drill 0.35)
  Top 0.406: R41.1 36.2,26.67 38.1,28.57 v38.1,29.84 | v38.1,36.2 38,36.09 IC10.8
  Bottom 0.406: v38.1,29.84 v38.1,36.2
N$41
  Top 0.406: IC5.3 44.45,27.94 42.06,25.55 R42.1
N$42
  Top 0.406: R42.2 D19.A
N$43
  Top 0.406: R41.2 D18.A
N$44
  Top 0.406: D17.A R40.2
N$45
  Top 0.406: R39.2 D16.A
N$46
  Top 0.406: IC5.6 48.26,28.73 R43.1
N$47
  Top 0.406: R43.2 D20.A
N$48
  Top 0.406: IC5.8 49.53,34.29 50.8,33.02 50.8,27.46 R44.1
N$49
  Top 0.406: D21.A R44.2
N$50
  Top 0.406: J6.10 10.16,8.26 11.43,6.99 R49.2
N$51  (via drill 0.35)
  Top 0.406: IC6.8 67.31,14.07 TP42.TP | v62.23,11.43 61.8,11 61.59,10.95 R48.2 | R49.1 12.55,2.39 13.34,3.17 v13.34,4.45
  Bottom 0.406: TP42.TP 66.04,15.24 v62.23,11.43 52.7,11.43 45.72,4.45 v13.34,4.45
N$52  (via drill 0.35)
  Top 0.406: TP41.TP 77.37,10.79 76.1,12.06 IC6.6 | R47.2 57,10.95 v57.78,10.16 | R50.1 8.74,2.39 v9.53,3.17
  Bottom 0.406: TP41.TP 76.2,10.79 75.56,10.16 v57.78,10.16 53.34,10.16 46.35,3.17 v9.53,3.17
N$53  (via drill 0.35)
  Top 0.406: IC6.3 TP40.TP | v53.34,8.26 53.34,10.16 52.55,10.95 R46.2 | R51.1 5.23,2.39 v5.71,1.91
  Bottom 0.406: TP40.TP v53.34,8.26 46.99,1.91 v5.71,1.91
N$54
  Top 0.406: R46.1 D22.A
N$55
  Top 0.406: R47.1 D23.A
N$56
  Top 0.406: R48.1 D24.A
N$57
  Top 0.406: J6.9 R50.2
N$58
  Top 0.406: J6.7 6.35,15.24 3.81,12.7 R51.2
N$59
  Top 0.508: J2.3 90.17,6.35 92.08,4.45 111.76,4.45 114.3,6.99 128.27,6.99 128.91,7.62 128.91,10.79 130.33,12.22 R54.1 TP37.TP 139.07,13.97 X3.1
N$60
  Top 0.508: J3.3 87,5.71 89.53,3.17 113.03,3.17 115.57,5.71 128.91,5.71 130.33,7.14 R53.1 TP38.TP 139.07,8.89 X3.2
N$61
  Top 0.508: X3.3 139.07,3.81 TP39.TP R52.1 130.33,2.69 129.54,1.91 87.63,1.91 J4.3
PHASE_A  (via drill 0.35)
  Top 0.406: R19.2 139.7,38.1 134.62,43.18 134.62,53.34 133.35,54.61 J12.1
  Top 0.61: U2.6 v105.41,48.9 v106.68,48.9 108.58,48.9 J11.1
  Top 1.27: J12.1 J11.1
  Bottom 0.508: TP24.TP 130.81,54.61
  Bottom 0.61: v105.41,48.9 v106.68,48.9 108.58,48.9 J11.1
  Bottom 1.27: J12.1 130.81,54.61 137.84,54.61 X2.1
PHASE_B  (via drill 0.35)
  Top 0.406: R20.2 135.89,38.1 133.35,40.64 133.35,46.35 131.44,48.26 J9.1
  Top 0.61: U2.5 v105.41,47.62 v106.68,47.62 110.49,47.62 111.12,48.26 J10.1
  Top 1.27: J9.1 J10.1
  Top 2.54: 127.02,48.28 J9.1
  Bottom 0.508: TP25.TP 130.81,48.26
  Bottom 0.61: v105.41,47.62 v106.68,47.62 110.49,47.62 111.12,48.26 J10.1
  Bottom 1.27: J9.1 130.81,48.26 139.07,48.26 X2.2
PHASE_C  (via drill 0.35)
  Top 0.406: R21.2 132.08,40.01 130.18,41.91 J7.1
  Top 0.61: U2.15 v87.63,48.9 v86.36,48.9
  Top 1.27: J7.1 J8.1
  Bottom 0.508: TP26.TP 130.81,41.91
  Bottom 1.27: X2.3 137.8,41.91 130.81,41.91 J7.1 | J8.1 109.86,46.35 97.79,46.35 95.25,48.9 v87.63,48.9 v86.36,48.9
PWM1  (via drill 0.35)
  Top 0.406: J6.1 7.62,25.4 v11.43,29.21 R24.2 | U2.7 v100.97,50.16 | J20.1 21.59,33.02 19.68,34.92 19.68,36.2 21.59,38.1 21.59,41.27 22.76,42.45 v28.57,42.45 TP30.TP | IC10.9 v35.56,37.47
  Bottom 0.305: 85.72,51.44 81.28,46.99 71.75,46.99 67.21,42.45
  Bottom 0.406: J20.1 J21.1 v11.43,29.21 | v100.97,50.16 99.69,50.16 98.42,51.44 85.72,51.44 | 67.21,42.45 v28.57,42.45 28.48,42.55 26.67,42.55 26.04,41.91 26.04,40.64 26.67,40.01 34.92,40.01 35.56,39.37 v35.56,37.47
PWM2  (via drill 0.35)
  Top 0.406: R23.2 v7.62,29.21 7.62,27.94 5.08,25.4 5.08,21.59 6.35,20.32 J6.3 | U2.4 101.6,46.35 100.97,46.99 v100.97,48.26 | J20.2 22.86,40.01 24.13,41.27 v27.3,41.27 31.75,41.27 33.02,42.55 TP31.TP | IC10.5 v34.29,28.57
  Bottom 0.305: 67.31,41.27 72.39,46.35 81.92,46.35 85.72,50.16
  Bottom 0.406: J20.2 13.97,35.56 v7.62,29.21 | v100.97,48.26 99.06,48.26 97.16,50.16 85.72,50.16 | 67.31,41.27 37.47,41.27 | 37.47,41.27 36.83,41.27 | 36.83,41.27 36.2,41.27 | 36.2,41.27 v27.3,41.27 | v34.29,28.57 34.29,34.29 36.83,36.83 36.83,40.64 | 36.83,41.27 36.83,40.64 | 36.2,41.27 36.83,40.64 | 36.83,40.64 37.47,41.27
PWM3  (via drill 0.35)
  Top 0.406: J6.5 5.08,17.78 3.81,19.05 v3.81,29.21 R22.2 | U2.14 v82.55,50.16 | IC10.2 30.48,28.57 29.84,27.94 26.04,27.94 24.77,26.67 J21.2
  Bottom 0.406: v3.81,29.21 6.35,26.67 J21.2 24.13,26.67 24.77,27.3 24.77,38.1 25.4,38.73 25.4,40.01 24.77,40.64 24.77,42.55 26.04,43.81 36.83,43.81 | v82.55,50.16 78.74,50.16 76.83,48.26 71.12,48.26 66.67,43.81 38.1,43.81 | 38.1,43.81 37.47,43.81 | 37.47,43.81 36.83,43.81 | 37.47,43.81 37.47,44.45 | TP32.TP 37.47,44.45 | 37.47,44.45 36.83,43.81 | 37.47,44.45 38.1,43.81
SUPPLY_MOTOR  (via drill 0.35)
  Top 0.406: C22.1 | C22.1 109.86,56.52
  Top 0.508: D5.A 84.26,60.96 v85.72,60.96
  Top 0.61: J14.1 109.86,56.52 v106.68,53.34 106.05,52.7 v105.41,52.7 U2.9 | U2.12 87,52.7 85.72,53.98
  Top 1.27: 85.72,53.98 v85.72,60.96 v87,60.96
  Top 2: C3.+ 132.08,60.96 J13.1 J15.1 J14.1
  Top 2.54: L2.2 TP6.TP C3.+
  Bottom 0.61: v105.41,52.7 106.05,52.7 v106.68,53.34 J14.1
  Bottom 1.016: v85.72,60.96 v87,60.96
  Bottom 1.27: J14.1 v87,60.96
V+  (via drill 0.35)
  Top 0.406: R7.2 33.66,59.05
  Top 0.813: v70.48,66.67 68.45,68.71 C4.1 63.37,68.58 IC1.5 57.15,69.22 55.88,70.48 48.26,70.48 43.81,66.04 36.83,66.04 35.56,64.77 35.56,60.96 33.66,59.05 29.84,59.05 28.57,57.78 v22.86,57.78
  Top 2.54: R4.A 120.95,81.58 TP5.TP 121.28,81.92 L2.1 120.95,85.42 R4.A
  Bottom 0.813: v70.48,66.67 71.75,65.41 108.58,65.41 120.65,77.47 TP5.TP | v22.86,57.78 10.79,57.78 8.89,55.88 8.89,50.8 | 8.89,50.8 J5.1 | 8.89,50.8 J5.2
V_OUT  (via drill 0.35)
  Top 0.406: IC3.6 v40.01,57.78 | IC3.2 v38.73,48.9 20.32,48.9 | R9.2 18.55,47.12 20.32,48.9 | TP14.TP 20.32,48.9
  Bottom 0.406: v40.01,57.78 38.73,56.52 v38.73,48.9
VIN_+
  Bottom 0.813: X1.2 11.43,93.98 TP1.TP
  Bottom 2.54: J1.PWR 26.94,82.82 29.21,85.09 29.21,92.71 | 29.21,92.71 30.48,93.98 | 30.48,93.98 F1.1A | 27.94,93.98 11.43,93.98 X1.2 | 27.94,93.98 30.48,93.98 | 29.21,92.71 27.94,93.98
(copper drawn outside any net)
  shapes: Top area x2041

### Text on the board
tNames: Leistungsansteuerung für BLDC-Motoren / IBZ Elektronik 2 Projekt 2019 / Darko, Pascal, Adrian, Oliver | 1 | FEEDBACK | 2 | 3